# EAGLE design alu_slice (EAGLE 7.3.0)
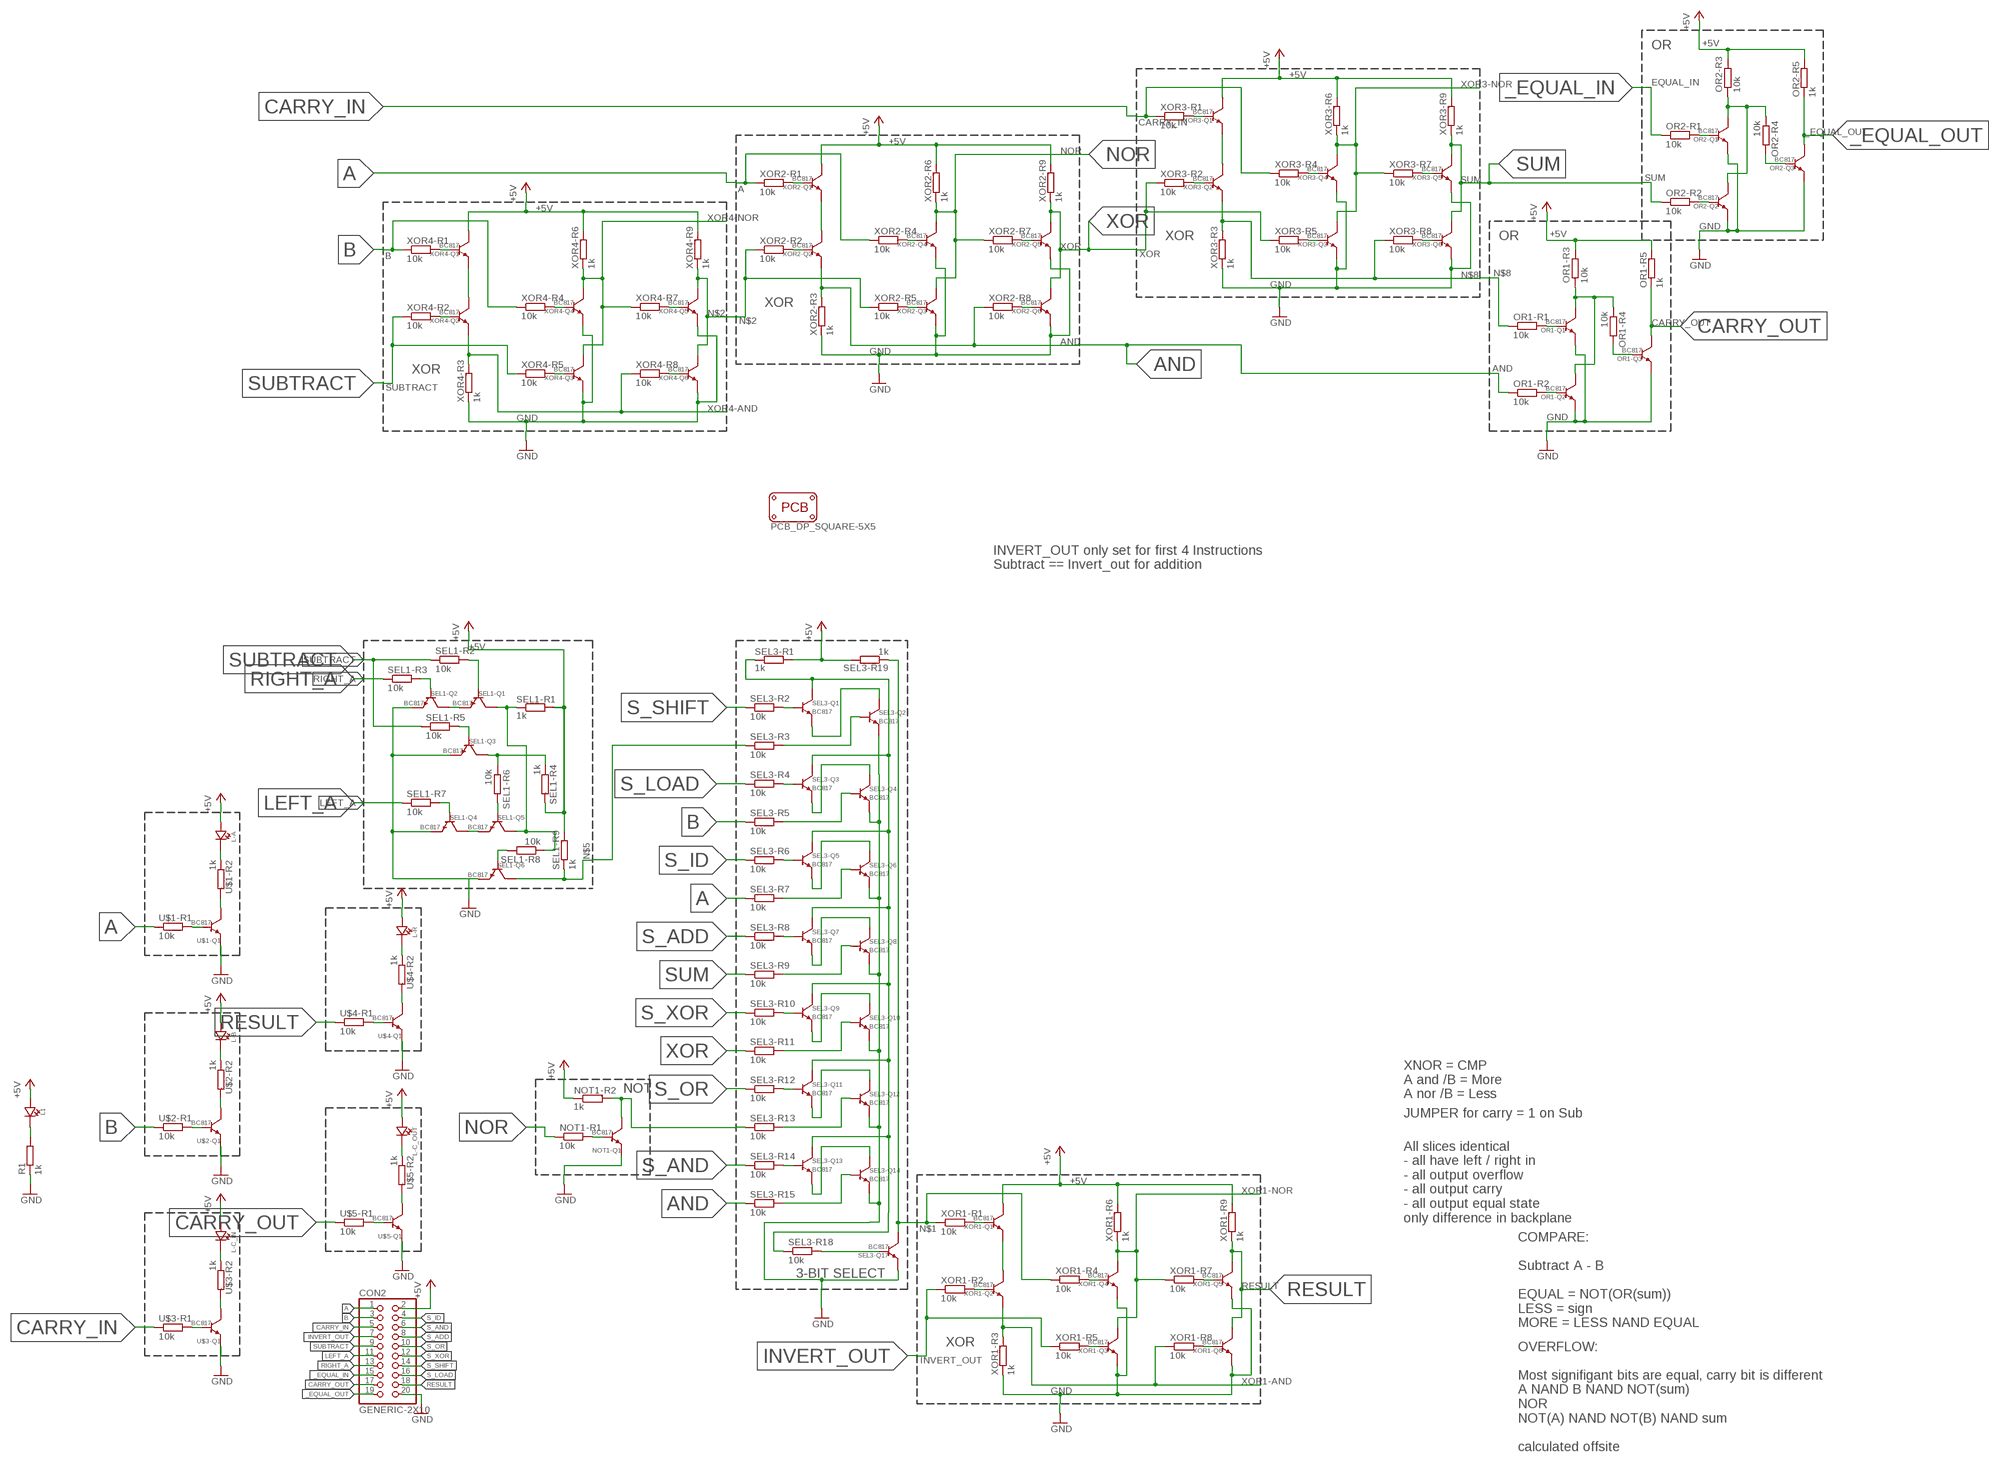
[diagram p0: schematic, sheet 1]

## Parts
CON2  GENERIC-2X10  [PINHEADER-100MIL-2X10-EDGE]
L1  LED0805  [CHIPLED_0805]
L-A  LED0603  [CHIPLED_0603]
L-B  LED0603  [CHIPLED_0603]
L-C_IN  LED0603  [CHIPLED_0603]
L-C_OUT  LED0603  [CHIPLED_0603]
L-R  LED0603  [CHIPLED_0603]
NOT1-Q1  BC817  TRANSISTOR-NPN-GENERICDEFAULT-SOT23-BEC  [SOT23]
NOT1-R1  10k  R-EU_R0603  [R0603]
NOT1-R2  1k  R-EU-MARKEDR0603  [R0603-MARK]
OR1-Q1  BC817  TRANSISTOR-NPN-GENERICDEFAULT-SOT23-BEC  [SOT23]
OR1-Q2  BC817  TRANSISTOR-NPN-GENERICDEFAULT-SOT23-BEC  [SOT23]
OR1-Q3  BC817  TRANSISTOR-NPN-GENERICDEFAULT-SOT23-BEC  [SOT23]
OR1-R1  10k  R-EU_R0603  [R0603]
OR1-R2  10k  R-EU_R0603  [R0603]
OR1-R3  10k  R-EU_R0603  [R0603]
OR1-R4  10k  R-EU_R0603  [R0603]
OR1-R5  1k  R-EU-MARKEDR0603  [R0603-MARK]
OR2-Q1  BC817  TRANSISTOR-NPN-GENERICDEFAULT-SOT23-BEC  [SOT23]
OR2-Q2  BC817  TRANSISTOR-NPN-GENERICDEFAULT-SOT23-BEC  [SOT23]
OR2-Q3  BC817  TRANSISTOR-NPN-GENERICDEFAULT-SOT23-BEC  [SOT23]
OR2-R1  10k  R-EU_R0603  [R0603]
OR2-R2  10k  R-EU_R0603  [R0603]
OR2-R3  10k  R-EU_R0603  [R0603]
OR2-R4  10k  R-EU_R0603  [R0603]
OR2-R5  1k  R-EU-MARKEDR0603  [R0603-MARK]
PCB1  PCB_DP_SQUARE-5X5  [DP5050_V1]
R1  1k  R-EU-MARKEDR0603  [R0603-MARK]
SEL1-Q1  BC817  TRANSISTOR-NPN-GENERICDEFAULT-SOT23-BEC  [SOT23]
SEL1-Q2  BC817  TRANSISTOR-NPN-GENERICDEFAULT-SOT23-BEC  [SOT23]
SEL1-Q3  BC817  TRANSISTOR-NPN-GENERICDEFAULT-SOT23-BEC  [SOT23]
SEL1-Q4  BC817  TRANSISTOR-NPN-GENERICDEFAULT-SOT23-BEC  [SOT23]
SEL1-Q5  BC817  TRANSISTOR-NPN-GENERICDEFAULT-SOT23-BEC  [SOT23]
SEL1-Q6  BC817  TRANSISTOR-NPN-GENERICDEFAULT-SOT23-BEC  [SOT23]
SEL1-R1  1k  R-EU-MARKEDR0603  [R0603-MARK]
SEL1-R2  10k  R-EU_R0603  [R0603]
SEL1-R3  10k  R-EU_R0603  [R0603]
SEL1-R4  1k  R-EU-MARKEDR0603  [R0603-MARK]
SEL1-R5  10k  R-EU_R0603  [R0603]
SEL1-R6  10k  R-EU_R0603  [R0603]
SEL1-R7  10k  R-EU_R0603  [R0603]
SEL1-R8  10k  R-EU_R0603  [R0603]
SEL1-R9  1k  R-EU-MARKEDR0603  [R0603-MARK]
SEL3-Q1  BC817  TRANSISTOR-NPN-GENERICDEFAULT-SOT23-BEC  [SOT23]
SEL3-Q2  BC817  TRANSISTOR-NPN-GENERICDEFAULT-SOT23-BEC  [SOT23]
SEL3-Q3  BC817  TRANSISTOR-NPN-GENERICDEFAULT-SOT23-BEC  [SOT23]
SEL3-Q4  BC817  TRANSISTOR-NPN-GENERICDEFAULT-SOT23-BEC  [SOT23]
SEL3-Q5  BC817  TRANSISTOR-NPN-GENERICDEFAULT-SOT23-BEC  [SOT23]
SEL3-Q6  BC817  TRANSISTOR-NPN-GENERICDEFAULT-SOT23-BEC  [SOT23]
SEL3-Q7  BC817  TRANSISTOR-NPN-GENERICDEFAULT-SOT23-BEC  [SOT23]
SEL3-Q8  BC817  TRANSISTOR-NPN-GENERICDEFAULT-SOT23-BEC  [SOT23]
SEL3-Q9  BC817  TRANSISTOR-NPN-GENERICDEFAULT-SOT23-BEC  [SOT23]
SEL3-Q10  BC817  TRANSISTOR-NPN-GENERICDEFAULT-SOT23-BEC  [SOT23]
SEL3-Q11  BC817  TRANSISTOR-NPN-GENERICDEFAULT-SOT23-BEC  [SOT23]
SEL3-Q12  BC817  TRANSISTOR-NPN-GENERICDEFAULT-SOT23-BEC  [SOT23]
SEL3-Q13  BC817  TRANSISTOR-NPN-GENERICDEFAULT-SOT23-BEC  [SOT23]
SEL3-Q14  BC817  TRANSISTOR-NPN-GENERICDEFAULT-SOT23-BEC  [SOT23]
SEL3-Q17  BC817  TRANSISTOR-NPN-GENERICDEFAULT-SOT23-BEC  [SOT23]
SEL3-R1  1k  R-EU-MARKEDR0603  [R0603-MARK]
SEL3-R2  10k  R-EU_R0603  [R0603]
SEL3-R3  10k  R-EU_R0603  [R0603]
SEL3-R4  10k  R-EU_R0603  [R0603]
SEL3-R5  10k  R-EU_R0603  [R0603]
SEL3-R6  10k  R-EU_R0603  [R0603]
SEL3-R7  10k  R-EU_R0603  [R0603]
SEL3-R8  10k  R-EU_R0603  [R0603]
SEL3-R9  10k  R-EU_R0603  [R0603]
SEL3-R10  10k  R-EU_R0603  [R0603]
SEL3-R11  10k  R-EU_R0603  [R0603]
SEL3-R12  10k  R-EU_R0603  [R0603]
SEL3-R13  10k  R-EU_R0603  [R0603]
SEL3-R14  10k  R-EU_R0603  [R0603]
SEL3-R15  10k  R-EU_R0603  [R0603]
SEL3-R18  10k  R-EU_R0603  [R0603]
SEL3-R19  1k  R-EU-MARKEDR0603  [R0603-MARK]
U$1-Q1  BC817  TRANSISTOR-NPN-GENERICDEFAULT-SOT23-BEC  [SOT23]
U$1-R1  10k  R-EU_R0603  [R0603]
U$1-R2  1k  R-EU-MARKEDR0603  [R0603-MARK]
U$2-Q1  BC817  TRANSISTOR-NPN-GENERICDEFAULT-SOT23-BEC  [SOT23]
U$2-R1  10k  R-EU_R0603  [R0603]
U$2-R2  1k  R-EU-MARKEDR0603  [R0603-MARK]
U$3-Q1  BC817  TRANSISTOR-NPN-GENERICDEFAULT-SOT23-BEC  [SOT23]
U$3-R1  10k  R-EU_R0603  [R0603]
U$3-R2  1k  R-EU-MARKEDR0603  [R0603-MARK]
U$4-Q1  BC817  TRANSISTOR-NPN-GENERICDEFAULT-SOT23-BEC  [SOT23]
U$4-R1  10k  R-EU_R0603  [R0603]
U$4-R2  1k  R-EU-MARKEDR0603  [R0603-MARK]
U$5-Q1  BC817  TRANSISTOR-NPN-GENERICDEFAULT-SOT23-BEC  [SOT23]
U$5-R1  10k  R-EU_R0603  [R0603]
U$5-R2  1k  R-EU-MARKEDR0603  [R0603-MARK]
XOR1-Q1  BC817  TRANSISTOR-NPN-GENERICDEFAULT-SOT23-BEC  [SOT23]
XOR1-Q2  BC817  TRANSISTOR-NPN-GENERICDEFAULT-SOT23-BEC  [SOT23]
XOR1-Q3  BC817  TRANSISTOR-NPN-GENERICDEFAULT-SOT23-BEC  [SOT23]
XOR1-Q4  BC817  TRANSISTOR-NPN-GENERICDEFAULT-SOT23-BEC  [SOT23]
XOR1-Q5  BC817  TRANSISTOR-NPN-GENERICDEFAULT-SOT23-BEC  [SOT23]
XOR1-Q6  BC817  TRANSISTOR-NPN-GENERICDEFAULT-SOT23-BEC  [SOT23]
XOR1-R1  10k  R-EU_R0603  [R0603]
XOR1-R2  10k  R-EU_R0603  [R0603]
XOR1-R3  1k  R-EU-MARKEDR0603  [R0603-MARK]
XOR1-R4  10k  R-EU_R0603  [R0603]
XOR1-R5  10k  R-EU_R0603  [R0603]
XOR1-R6  1k  R-EU-MARKEDR0603  [R0603-MARK]
XOR1-R7  10k  R-EU_R0603  [R0603]
XOR1-R8  10k  R-EU_R0603  [R0603]
XOR1-R9  1k  R-EU-MARKEDR0603  [R0603-MARK]
XOR2-Q1  BC817  TRANSISTOR-NPN-GENERICDEFAULT-SOT23-BEC  [SOT23]
XOR2-Q2  BC817  TRANSISTOR-NPN-GENERICDEFAULT-SOT23-BEC  [SOT23]
XOR2-Q3  BC817  TRANSISTOR-NPN-GENERICDEFAULT-SOT23-BEC  [SOT23]
XOR2-Q4  BC817  TRANSISTOR-NPN-GENERICDEFAULT-SOT23-BEC  [SOT23]
XOR2-Q5  BC817  TRANSISTOR-NPN-GENERICDEFAULT-SOT23-BEC  [SOT23]
XOR2-Q6  BC817  TRANSISTOR-NPN-GENERICDEFAULT-SOT23-BEC  [SOT23]
XOR2-R1  10k  R-EU_R0603  [R0603]
XOR2-R2  10k  R-EU_R0603  [R0603]
XOR2-R3  1k  R-EU-MARKEDR0603  [R0603-MARK]
XOR2-R4  10k  R-EU_R0603  [R0603]
XOR2-R5  10k  R-EU_R0603  [R0603]
XOR2-R6  1k  R-EU-MARKEDR0603  [R0603-MARK]
XOR2-R7  10k  R-EU_R0603  [R0603]
XOR2-R8  10k  R-EU_R0603  [R0603]
XOR2-R9  1k  R-EU-MARKEDR0603  [R0603-MARK]
XOR3-Q1  BC817  TRANSISTOR-NPN-GENERICDEFAULT-SOT23-BEC  [SOT23]
XOR3-Q2  BC817  TRANSISTOR-NPN-GENERICDEFAULT-SOT23-BEC  [SOT23]
XOR3-Q3  BC817  TRANSISTOR-NPN-GENERICDEFAULT-SOT23-BEC  [SOT23]
XOR3-Q4  BC817  TRANSISTOR-NPN-GENERICDEFAULT-SOT23-BEC  [SOT23]
XOR3-Q5  BC817  TRANSISTOR-NPN-GENERICDEFAULT-SOT23-BEC  [SOT23]
XOR3-Q6  BC817  TRANSISTOR-NPN-GENERICDEFAULT-SOT23-BEC  [SOT23]
XOR3-R1  10k  R-EU_R0603  [R0603]
XOR3-R2  10k  R-EU_R0603  [R0603]
XOR3-R3  1k  R-EU-MARKEDR0603  [R0603-MARK]
XOR3-R4  10k  R-EU_R0603  [R0603]
XOR3-R5  10k  R-EU_R0603  [R0603]
XOR3-R6  1k  R-EU-MARKEDR0603  [R0603-MARK]
XOR3-R7  10k  R-EU_R0603  [R0603]
XOR3-R8  10k  R-EU_R0603  [R0603]
XOR3-R9  1k  R-EU-MARKEDR0603  [R0603-MARK]
XOR4-Q1  BC817  TRANSISTOR-NPN-GENERICDEFAULT-SOT23-BEC  [SOT23]
XOR4-Q2  BC817  TRANSISTOR-NPN-GENERICDEFAULT-SOT23-BEC  [SOT23]
XOR4-Q3  BC817  TRANSISTOR-NPN-GENERICDEFAULT-SOT23-BEC  [SOT23]
XOR4-Q4  BC817  TRANSISTOR-NPN-GENERICDEFAULT-SOT23-BEC  [SOT23]
XOR4-Q5  BC817  TRANSISTOR-NPN-GENERICDEFAULT-SOT23-BEC  [SOT23]
XOR4-Q6  BC817  TRANSISTOR-NPN-GENERICDEFAULT-SOT23-BEC  [SOT23]
XOR4-R1  10k  R-EU_R0603  [R0603]
XOR4-R2  10k  R-EU_R0603  [R0603]
XOR4-R3  1k  R-EU-MARKEDR0603  [R0603-MARK]
XOR4-R4  10k  R-EU_R0603  [R0603]
XOR4-R5  10k  R-EU_R0603  [R0603]
XOR4-R6  1k  R-EU-MARKEDR0603  [R0603-MARK]
XOR4-R7  10k  R-EU_R0603  [R0603]
XOR4-R8  10k  R-EU_R0603  [R0603]
XOR4-R9  1k  R-EU-MARKEDR0603  [R0603-MARK]

## Nets
+5V [PWR]: CON2.2 L1.A L-A.A L-B.A L-C_IN.A L-C_OUT.A L-R.A NOT1-R2.1 OR1-R3.2 OR1-R5.2 OR2-R3.2 OR2-R5.2 SEL1-R1.2 SEL1-R4.2 SEL1-R9.2 SEL3-R1.2 SEL3-R19.2 XOR1-Q1.P$3(COLLECTOR) XOR1-R6.2 XOR1-R9.2 XOR2-Q1.P$3(COLLECTOR) XOR2-R6.2 XOR2-R9.2 XOR3-Q1.P$3(COLLECTOR) XOR3-R6.2 XOR3-R9.2 XOR4-Q1.P$3(COLLECTOR) XOR4-R6.2 XOR4-R9.2
_EQUAL_IN: CON2.15 OR2-R1.1
_EQUAL_OUT: CON2.19 OR2-Q3.P$3(COLLECTOR) OR2-R5.1
A: CON2.1 SEL3-R7.1 U$1-R1.1 XOR2-R1.1 XOR2-R4.1
AND: OR1-R2.1 SEL3-R15.1 XOR2-Q2.P$2(EMITTER) XOR2-R3.2 XOR2-R8.1
B: CON2.3 SEL3-R5.1 U$2-R1.1 XOR4-R1.1 XOR4-R4.1
CARRY_IN: CON2.5 U$3-R1.1 XOR3-R1.1 XOR3-R4.1
CARRY_OUT: CON2.17 OR1-Q3.P$3(COLLECTOR) OR1-R5.1 U$5-R1.1
GND [PWR]: CON2.20 NOT1-Q1.P$2(EMITTER) OR1-Q1.P$2(EMITTER) OR1-Q2.P$2(EMITTER) OR1-Q3.P$2(EMITTER) OR2-Q1.P$2(EMITTER) OR2-Q2.P$2(EMITTER) OR2-Q3.P$2(EMITTER) R1.1 SEL1-Q2.P$2(EMITTER) SEL1-Q3.P$2(EMITTER) SEL1-Q4.P$2(EMITTER) SEL1-Q6.P$2(EMITTER) SEL3-Q2.P$2(EMITTER) SEL3-Q4.P$2(EMITTER) SEL3-Q6.P$2(EMITTER) SEL3-Q8.P$2(EMITTER) SEL3-Q10.P$2(EMITTER) SEL3-Q12.P$2(EMITTER) SEL3-Q14.P$2(EMITTER) SEL3-Q17.P$2(EMITTER) U$1-Q1.P$2(EMITTER) U$2-Q1.P$2(EMITTER) U$3-Q1.P$2(EMITTER) U$4-Q1.P$2(EMITTER) U$5-Q1.P$2(EMITTER) XOR1-Q3.P$2(EMITTER) XOR1-Q4.P$2(EMITTER) XOR1-Q5.P$2(EMITTER) XOR1-Q6.P$2(EMITTER) XOR1-R3.1 XOR2-Q3.P$2(EMITTER) XOR2-Q4.P$2(EMITTER) XOR2-Q5.P$2(EMITTER) XOR2-Q6.P$2(EMITTER) XOR2-R3.1 XOR3-Q3.P$2(EMITTER) XOR3-Q4.P$2(EMITTER) XOR3-Q5.P$2(EMITTER) XOR3-Q6.P$2(EMITTER) XOR3-R3.1 XOR4-Q3.P$2(EMITTER) XOR4-Q4.P$2(EMITTER) XOR4-Q5.P$2(EMITTER) XOR4-Q6.P$2(EMITTER) XOR4-R3.1
INVERT_OUT: CON2.7 XOR1-R2.1 XOR1-R5.1
LEFT_A: CON2.11 SEL1-R7.1
N$1: SEL3-Q17.P$3(COLLECTOR) SEL3-R19.1 XOR1-R1.1 XOR1-R4.1
N$2: XOR2-R2.1 XOR2-R5.1 XOR4-Q5.P$3(COLLECTOR) XOR4-Q6.P$3(COLLECTOR) XOR4-R9.1
N$3: NOT1-Q1.P$3(COLLECTOR) NOT1-R2.2 SEL3-R13.1
N$5: SEL1-Q6.P$3(COLLECTOR) SEL1-R9.1 SEL3-R3.1
N$6: L1.C R1.2
N$8: OR1-R1.1 XOR3-Q2.P$2(EMITTER) XOR3-R3.2 XOR3-R8.1
NOR: NOT1-R1.1 XOR2-Q3.P$3(COLLECTOR) XOR2-Q4.P$3(COLLECTOR) XOR2-R6.1 XOR2-R7.1
NOT1-N$14: NOT1-Q1.P$1(BASE) NOT1-R1.2
OR1-N$7: OR1-Q1.P$1(BASE) OR1-R1.2
OR1-N$9: OR1-Q2.P$1(BASE) OR1-R2.2
OR1-N$10: OR1-Q3.P$1(BASE) OR1-R4.2
OR1-N$11: OR1-Q1.P$3(COLLECTOR) OR1-Q2.P$3(COLLECTOR) OR1-R3.1 OR1-R4.1
OR2-N$7: OR2-Q1.P$1(BASE) OR2-R1.2
OR2-N$9: OR2-Q2.P$1(BASE) OR2-R2.2
OR2-N$10: OR2-Q3.P$1(BASE) OR2-R4.2
OR2-N$11: OR2-Q1.P$3(COLLECTOR) OR2-Q2.P$3(COLLECTOR) OR2-R3.1 OR2-R4.1
RESULT: CON2.18 U$4-R1.1 XOR1-Q5.P$3(COLLECTOR) XOR1-Q6.P$3(COLLECTOR) XOR1-R9.1
RIGHT_A: CON2.13 SEL1-R3.1
S_ADD: CON2.8 SEL3-R8.1
S_AND: CON2.6 SEL3-R14.1
S_ID: CON2.4 SEL3-R6.1
S_LOAD: CON2.16 SEL3-R4.1
S_OR: CON2.10 SEL3-R12.1
S_SHIFT: CON2.14 SEL3-R2.1
S_XOR: CON2.12 SEL3-R10.1
SEL1-I-S2: SEL1-Q3.P$3(COLLECTOR) SEL1-R4.1 SEL1-R6.1
SEL1-N$53: SEL1-Q1.P$1(BASE) SEL1-R2.2
SEL1-N$55: SEL1-Q2.P$1(BASE) SEL1-R3.2
SEL1-N$56: SEL1-Q1.P$2(EMITTER) SEL1-Q2.P$3(COLLECTOR)
SEL1-N$57: SEL1-Q5.P$1(BASE) SEL1-R6.2
SEL1-N$58: SEL1-Q4.P$1(BASE) SEL1-R7.2
SEL1-N$59: SEL1-Q4.P$3(COLLECTOR) SEL1-Q5.P$2(EMITTER)
SEL1-N$60: SEL1-Q6.P$1(BASE) SEL1-R8.2
SEL1-N$62: SEL1-Q3.P$1(BASE) SEL1-R5.2
SEL1-SEL_INT1: SEL1-Q1.P$3(COLLECTOR) SEL1-Q5.P$3(COLLECTOR) SEL1-R1.1 SEL1-R8.1
SEL3-N$27: SEL3-Q1.P$1(BASE) SEL3-R2.2
SEL3-N$28: SEL3-Q2.P$1(BASE) SEL3-R3.2
SEL3-N$29: SEL3-Q1.P$2(EMITTER) SEL3-Q2.P$3(COLLECTOR)
SEL3-N$32: SEL3-Q3.P$1(BASE) SEL3-R4.2
SEL3-N$33: SEL3-Q4.P$1(BASE) SEL3-R5.2
SEL3-N$34: SEL3-Q3.P$2(EMITTER) SEL3-Q4.P$3(COLLECTOR)
SEL3-N$35: SEL3-Q5.P$1(BASE) SEL3-R6.2
SEL3-N$36: SEL3-Q6.P$1(BASE) SEL3-R7.2
SEL3-N$37: SEL3-Q5.P$2(EMITTER) SEL3-Q6.P$3(COLLECTOR)
SEL3-N$38: SEL3-Q7.P$1(BASE) SEL3-R8.2
SEL3-N$39: SEL3-Q8.P$1(BASE) SEL3-R9.2
SEL3-N$40: SEL3-Q7.P$2(EMITTER) SEL3-Q8.P$3(COLLECTOR)
SEL3-N$41: SEL3-Q9.P$1(BASE) SEL3-R10.2
SEL3-N$42: SEL3-Q10.P$1(BASE) SEL3-R11.2
SEL3-N$43: SEL3-Q9.P$2(EMITTER) SEL3-Q10.P$3(COLLECTOR)
SEL3-N$44: SEL3-Q11.P$1(BASE) SEL3-R12.2
SEL3-N$45: SEL3-Q12.P$1(BASE) SEL3-R13.2
SEL3-N$46: SEL3-Q11.P$2(EMITTER) SEL3-Q12.P$3(COLLECTOR)
SEL3-N$47: SEL3-Q13.P$1(BASE) SEL3-R14.2
SEL3-N$48: SEL3-Q14.P$1(BASE) SEL3-R15.2
SEL3-N$49: SEL3-Q13.P$2(EMITTER) SEL3-Q14.P$3(COLLECTOR)
SEL3-N$54: SEL3-Q17.P$1(BASE) SEL3-R18.2
SEL3-SEL_INT: SEL3-Q1.P$3(COLLECTOR) SEL3-Q3.P$3(COLLECTOR) SEL3-Q5.P$3(COLLECTOR) SEL3-Q7.P$3(COLLECTOR) SEL3-Q9.P$3(COLLECTOR) SEL3-Q11.P$3(COLLECTOR) SEL3-Q13.P$3(COLLECTOR) SEL3-R1.1 SEL3-R18.1
SUBTRACT: CON2.9 SEL1-R2.1 SEL1-R5.1 XOR4-R2.1 XOR4-R5.1
SUM: OR2-R2.1 SEL3-R9.1 XOR3-Q5.P$3(COLLECTOR) XOR3-Q6.P$3(COLLECTOR) XOR3-R9.1
U$1-INT: L-A.C U$1-R2.1
U$1-N$1: U$1-Q1.P$3(COLLECTOR) U$1-R2.2
U$1-N$16: U$1-Q1.P$1(BASE) U$1-R1.2
U$2-INT: L-B.C U$2-R2.1
U$2-N$1: U$2-Q1.P$3(COLLECTOR) U$2-R2.2
U$2-N$16: U$2-Q1.P$1(BASE) U$2-R1.2
U$3-INT: L-C_IN.C U$3-R2.1
U$3-N$1: U$3-Q1.P$3(COLLECTOR) U$3-R2.2
U$3-N$16: U$3-Q1.P$1(BASE) U$3-R1.2
U$4-INT: L-R.C U$4-R2.1
U$4-N$1: U$4-Q1.P$3(COLLECTOR) U$4-R2.2
U$4-N$16: U$4-Q1.P$1(BASE) U$4-R1.2
U$5-INT: L-C_OUT.C U$5-R2.1
U$5-N$1: U$5-Q1.P$3(COLLECTOR) U$5-R2.2
U$5-N$16: U$5-Q1.P$1(BASE) U$5-R1.2
XOR: SEL3-R11.1 XOR2-Q5.P$3(COLLECTOR) XOR2-Q6.P$3(COLLECTOR) XOR2-R9.1 XOR3-R2.1 XOR3-R5.1
XOR1-AND: XOR1-Q2.P$2(EMITTER) XOR1-R3.2 XOR1-R8.1
XOR1-N$19: XOR1-Q1.P$2(EMITTER) XOR1-Q2.P$3(COLLECTOR)
XOR1-N$21: XOR1-Q1.P$1(BASE) XOR1-R1.2
XOR1-N$22: XOR1-Q2.P$1(BASE) XOR1-R2.2
XOR1-N$23: XOR1-Q3.P$1(BASE) XOR1-R5.2
XOR1-N$24: XOR1-Q4.P$1(BASE) XOR1-R4.2
XOR1-N$25: XOR1-Q6.P$1(BASE) XOR1-R8.2
XOR1-N$26: XOR1-Q5.P$1(BASE) XOR1-R7.2
XOR1-NOR: XOR1-Q3.P$3(COLLECTOR) XOR1-Q4.P$3(COLLECTOR) XOR1-R6.1 XOR1-R7.1
XOR2-N$19: XOR2-Q1.P$2(EMITTER) XOR2-Q2.P$3(COLLECTOR)
XOR2-N$21: XOR2-Q1.P$1(BASE) XOR2-R1.2
XOR2-N$22: XOR2-Q2.P$1(BASE) XOR2-R2.2
XOR2-N$23: XOR2-Q3.P$1(BASE) XOR2-R5.2
XOR2-N$24: XOR2-Q4.P$1(BASE) XOR2-R4.2
XOR2-N$25: XOR2-Q6.P$1(BASE) XOR2-R8.2
XOR2-N$26: XOR2-Q5.P$1(BASE) XOR2-R7.2
XOR3-N$19: XOR3-Q1.P$2(EMITTER) XOR3-Q2.P$3(COLLECTOR)
XOR3-N$21: XOR3-Q1.P$1(BASE) XOR3-R1.2
XOR3-N$22: XOR3-Q2.P$1(BASE) XOR3-R2.2
XOR3-N$23: XOR3-Q3.P$1(BASE) XOR3-R5.2
XOR3-N$24: XOR3-Q4.P$1(BASE) XOR3-R4.2
XOR3-N$25: XOR3-Q6.P$1(BASE) XOR3-R8.2
XOR3-N$26: XOR3-Q5.P$1(BASE) XOR3-R7.2
XOR3-NOR: XOR3-Q3.P$3(COLLECTOR) XOR3-Q4.P$3(COLLECTOR) XOR3-R6.1 XOR3-R7.1
XOR4-AND: XOR4-Q2.P$2(EMITTER) XOR4-R3.2 XOR4-R8.1
XOR4-N$19: XOR4-Q1.P$2(EMITTER) XOR4-Q2.P$3(COLLECTOR)
XOR4-N$21: XOR4-Q1.P$1(BASE) XOR4-R1.2
XOR4-N$22: XOR4-Q2.P$1(BASE) XOR4-R2.2
XOR4-N$23: XOR4-Q3.P$1(BASE) XOR4-R5.2
XOR4-N$24: XOR4-Q4.P$1(BASE) XOR4-R4.2
XOR4-N$25: XOR4-Q6.P$1(BASE) XOR4-R8.2
XOR4-N$26: XOR4-Q5.P$1(BASE) XOR4-R7.2
XOR4-NOR: XOR4-Q3.P$3(COLLECTOR) XOR4-Q4.P$3(COLLECTOR) XOR4-R6.1 XOR4-R7.1

## Notes on the sheet
- OR
- XOR | OR
- XOR
- XOR
- INVERT_OUT only set for first 4 Instructions
  Subtract == Invert_out for addition
- XNOR = CMP
- NOT
- A and /B = More
  A nor /B = Less
- JUMPER for carry = 1 on Sub
- All slices identical
  - all have left / right in
  - all output overflow
  - all output carry
  - all output equal state
  only difference in backplane
- 3-BIT SELECT
- COMPARE:
  
  Subtract A - B
  
  EQUAL = NOT(OR(sum))
  LESS = sign
  MORE = LESS NAND EQUAL
- XOR
- OVERFLOW:
  
  Most signifigant bits are equal, carry bit is different
  A NAND B NAND NOT(sum)
  NOR
  NOT(A) NAND NOT(B) NAND sum
  
  calculated offsite

## Library data of the parts
CON2 = p.peter-connectors:GENERIC-2X10
L1 L-A L-B L-C_IN L-C_OUT L-R = p.peter-leds:LED
NOT1-Q1 OR1-Q1-OR1-Q3 OR2-Q1-OR2-Q3 SEL1-Q1-SEL1-Q6 SEL3-Q1-SEL3-Q14 SEL3-Q17 U$1-Q1 U$2-Q1 U$3-Q1 U$4-Q1 U$5-Q1 XOR1-Q1-XOR1-Q6 XOR2-Q1-XOR2-Q6 XOR3-Q1-XOR3-Q6 XOR4-Q1-XOR4-Q6 = p.peter-gator:TRANSISTOR-NPN-GENERIC; SV_SPICE_MODEL: NPN (); SV_SPICE_ORDER: COLLECTOR;BASE;EMITTER; SV_SPICE_PREFIX: Q
NOT1-R1 OR1-R1-OR1-R4 OR2-R1-OR2-R4 SEL1-R2 SEL1-R3 SEL1-R5-SEL1-R8 SEL3-R2-SEL3-R15 SEL3-R18 U$1-R1 U$2-R1 U$3-R1 U$4-R1 U$5-R1 XOR1-R1 XOR1-R2 XOR1-R4 XOR1-R5 XOR1-R7 XOR1-R8 XOR2-R1 XOR2-R2 XOR2-R4 XOR2-R5 XOR2-R7 XOR2-R8 XOR3-R1 XOR3-R2 XOR3-R4 XOR3-R5 XOR3-R7 XOR3-R8 XOR4-R1 XOR4-R2 XOR4-R4 XOR4-R5 XOR4-R7 XOR4-R8 = p.peter-gator:R-EU_: RESISTOR, European symbol; SV_SPICE_ORDER: 1;2; SV_SPICE_PREFIX: R
NOT1-R2 OR1-R5 OR2-R5 R1 SEL1-R1 SEL1-R4 SEL1-R9 SEL3-R1 SEL3-R19 U$1-R2 U$2-R2 U$3-R2 U$4-R2 U$5-R2 XOR1-R3 XOR1-R6 XOR1-R9 XOR2-R3 XOR2-R6 XOR2-R9 XOR3-R3 XOR3-R6 XOR3-R9 XOR4-R3 XOR4-R6 XOR4-R9 = p.peter-rcl:R-EU-MARKED
PCB1 = dp_pcb:PCB_DP_SQUARE: Dangerous Prototypes Standard Square PCB sizes

## Net classes
0 default: width 0.2 mm, drill 0.5 mm
1 PWR: width 0.2 mm, drill 0.5 mm

## Board
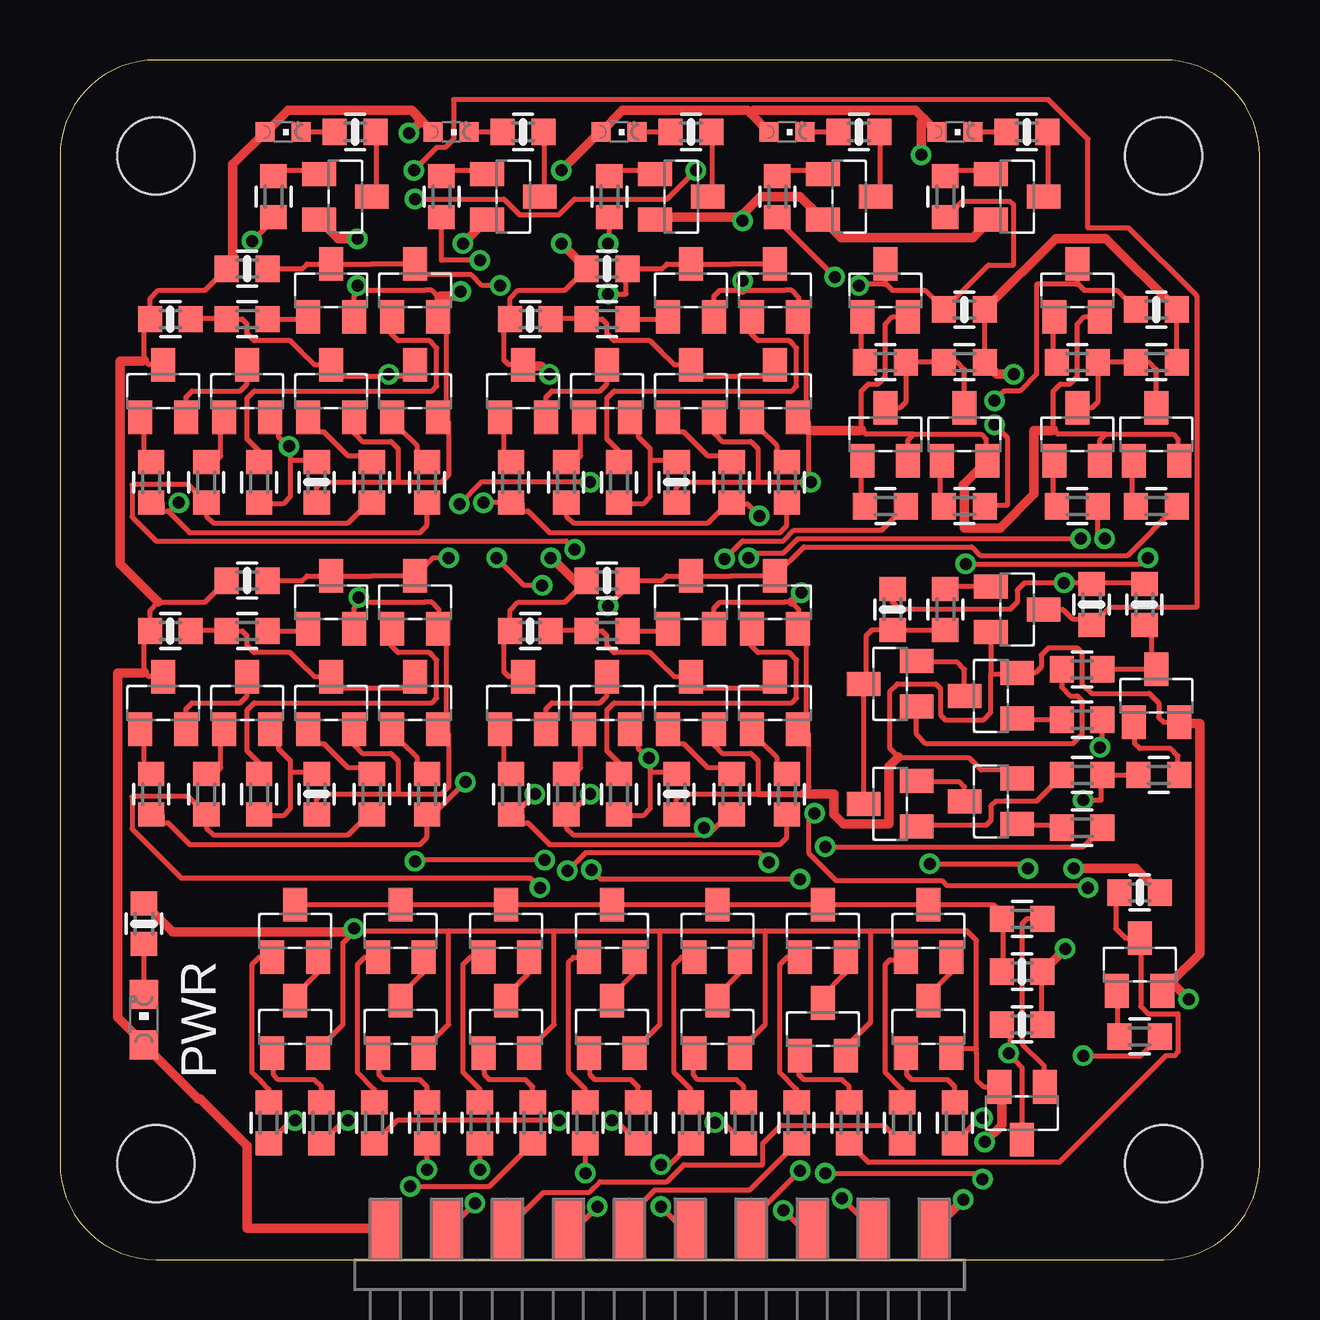
[diagram p1: board, top side]
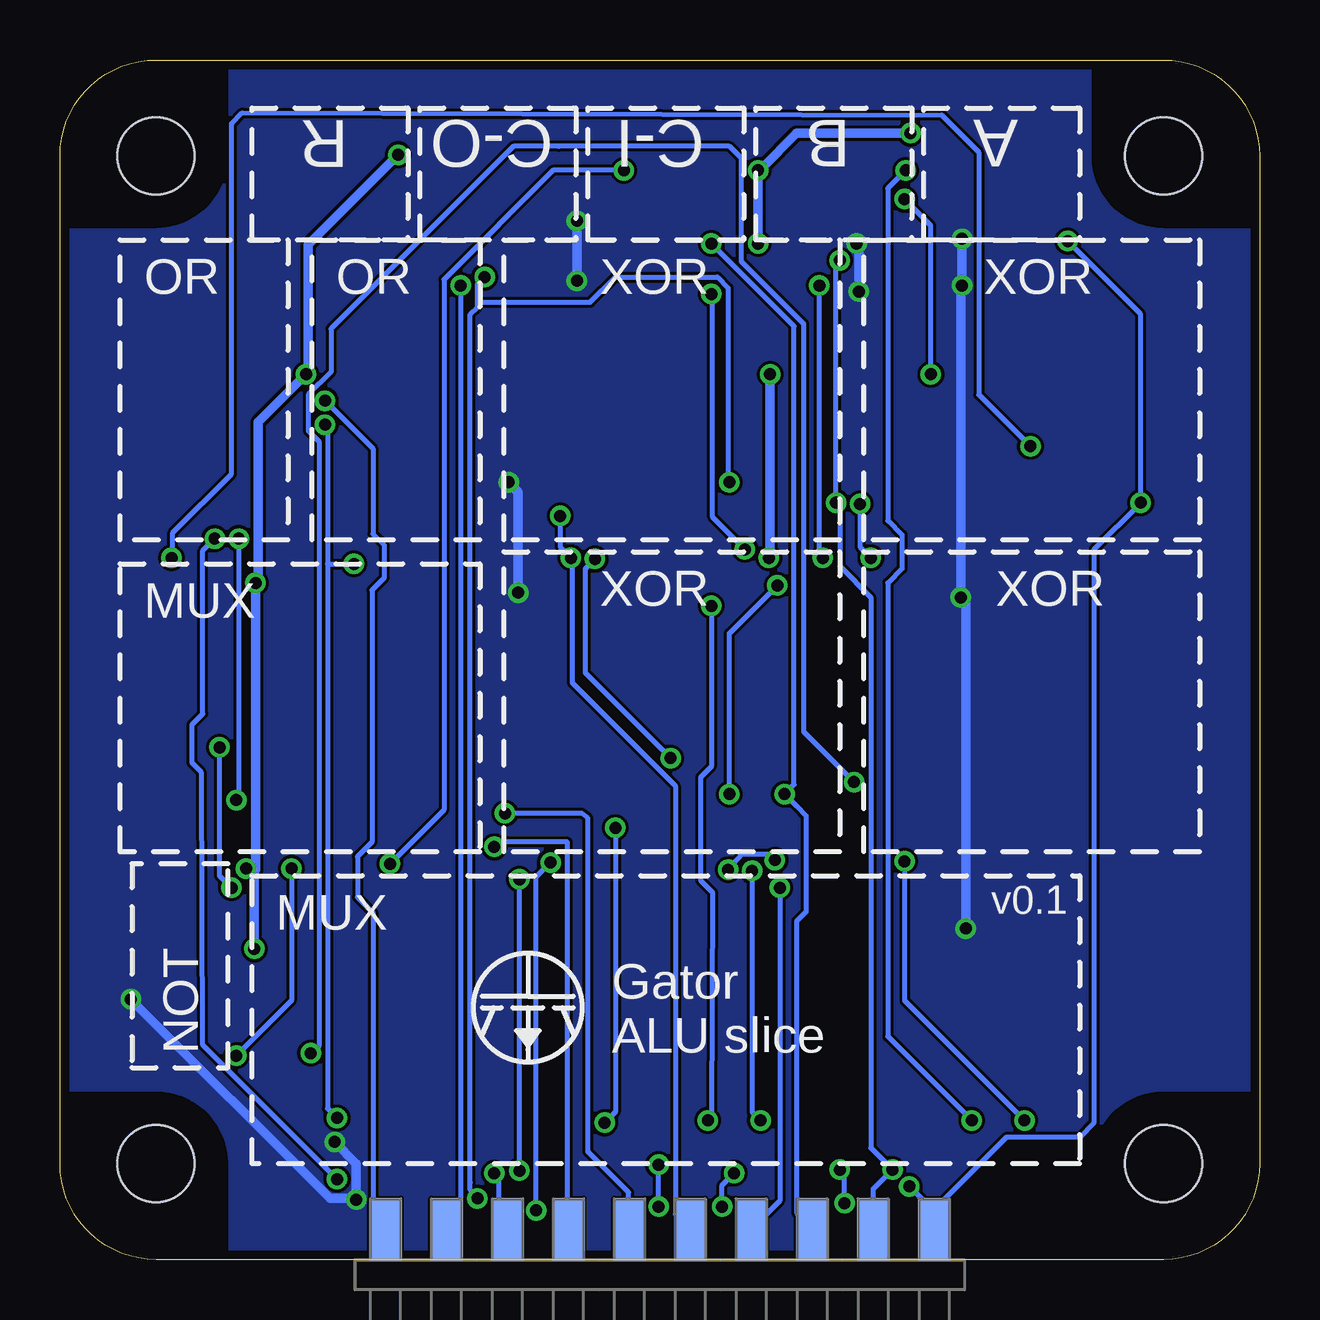
[diagram p2: board, bottom side, seen from below]

Size 50 x 50 mm. Coordinates in mm from the lower left corner, seen from the top.
Copper layers (1*16): Top 0.0356mm / dielectric 1.5011mm / Bottom 0.0356mm
Design rules "oshpark *": minimum track width 5mil, minimum drill 12mil, track to track 5mil, track to pad 5mil, pad to pad 5mil, via to via 5mil, smd to smd 5mil, copper to edge 15mil, drill to drill 6mil, minimum pad ring 7mil, minimum via ring 7mil, stop-mask expansion 4mil, vias tented up to drill 4.1mm, thermal gap 10mil

### Footprints (pad centres in the part's own frame; a part is rotated, then mirrored left to right if it is on the bottom)
PINHEADER-100MIL-2X10-EDGE = smd 1.27 x 2.54 bottom: 1 -11.43,1.27; 3 -8.89,1.27; 5 -6.35,1.27; 7 -3.81,1.27; 9 -1.27,1.27; 11 1.27,1.27; 13 3.81,1.27; 15 6.35,1.27; 17 8.89,1.27; 19 11.43,1.27 | smd 1.27 x 2.54: 2 -11.43,1.27; 4 -8.89,1.27; 6 -6.35,1.27; 8 -3.81,1.27; 10 -1.27,1.27; 12 1.27,1.27; 14 3.81,1.27; 16 6.35,1.27; 18 8.89,1.27; 20 11.43,1.27
CHIPLED_0805 = smd 1.2 x 1.2: A 0,-1.05; C 0,1.05
CHIPLED_0603 = smd 0.8 x 0.8: A 0,-0.75; C 0,0.75
SOT23 = smd 1 x 1.4: P$1 -0.95,-1.1; P$2 0.95,-1.1; P$3 0,1.1
R0603 = smd 1 x 1.1: 1 -0.85,0; 2 0.85,0
R0603-MARK = smd 1 x 1.1: 1 -0.85,0; 2 0.85,0
DP5050_V1 = hole 3.2: 4,4; 46,4; 46,46; 4,46

### Placement (x,y rotation side)
CON2  25,0 0 top
L1  3.5,10 0 top
L-A  9.3,47 270 top
L-B  16.3,47 270 top
L-C_IN  23.3,47 270 top
L-C_OUT  37.3,47 270 top
L-R  30.3,47 270 top
NOT1-Q1  45,12.3 0 top
NOT1-R1  45,9.3 180 top
NOT1-R2  45,15.3 180 top
OR1-Q1  34.4,34.4 0 top
OR1-Q2  37.7,34.4 0 top
OR1-Q3  34.4,40.4 0 top
OR1-R1  34.4,31.4 180 top
OR1-R2  37.7,31.4 180 top
OR1-R3  37.7,37.4 0 top
OR1-R4  34.4,37.4 180 top
OR1-R5  37.7,39.6 0 top
OR2-Q1  42.4,34.4 0 top
OR2-Q2  45.7,34.4 0 top
OR2-Q3  42.4,40.4 0 top
OR2-R1  42.4,31.4 180 top
OR2-R2  45.7,31.4 180 top
OR2-R3  45.7,37.4 0 top
OR2-R4  42.4,37.4 180 top
OR2-R5  45.7,39.6 0 top
PCB1  0,0 0 top
R1  3.5,14 270 top
SEL1-Q1  34.6,19 90 top
SEL1-Q2  38.8,19.1 90 top
SEL1-Q3  45.7,23.5 0 top
SEL1-Q4  38.8,23.5 90 top
SEL1-Q5  34.6,24 90 top
SEL1-Q6  39.9,27.1 270 top
SEL1-R1  34.7,27.1 90 top
SEL1-R2  42.6,20.2 180 top
SEL1-R3  42.6,18 180 top
SEL1-R4  45.2,27.3 90 top
SEL1-R5  45.8,20.2 0 top
SEL1-R6  42.6,24.6 180 top
SEL1-R7  42.6,22.5 180 top
SEL1-R8  36.9,27.1 90 top
SEL1-R9  43,27.3 90 top
SEL3-Q1  9.8,13.7 0 top
SEL3-Q2  9.8,9.7 0 top
SEL3-Q3  14.2,13.7 0 top
SEL3-Q4  14.2,9.7 0 top
SEL3-Q5  18.6,13.7 0 top
SEL3-Q6  18.6,9.7 0 top
SEL3-Q7  23,13.7 0 top
SEL3-Q8  23,9.7 0 top
SEL3-Q9  27.4,13.7 0 top
SEL3-Q10  27.4,9.7 0 top
SEL3-Q11  31.8,13.7 0 top
SEL3-Q12  31.8,9.6 0 top
SEL3-Q13  36.2,13.7 0 top
SEL3-Q14  36.2,9.7 0 top
SEL3-Q17  40.1,6.1 180 top
SEL3-R1  40.1,12 0 top
SEL3-R2  8.7,5.7 90 top
SEL3-R3  10.9,5.7 90 top
SEL3-R4  13.1,5.7 90 top
SEL3-R5  15.3,5.7 90 top
SEL3-R6  17.5,5.7 90 top
SEL3-R7  19.7,5.7 90 top
SEL3-R8  21.9,5.7 90 top
SEL3-R9  24.1,5.7 90 top
SEL3-R10  26.3,5.7 90 top
SEL3-R11  28.5,5.7 90 top
SEL3-R12  30.7,5.7 90 top
SEL3-R13  32.9,5.7 90 top
SEL3-R14  35.1,5.7 90 top
SEL3-R15  37.3,5.7 90 top
SEL3-R18  40.1,14.2 0 top
SEL3-R19  40.1,9.8 0 top
U$1  [LOGO-JUSTGEEK-XS]  30.5,10.5 0 bottom
U$1-Q1  11.9,44.3 270 top
U$1-R1  8.9,44.3 90 top
U$1-R2  12.3,47 0 top
U$2-Q1  18.9,44.3 270 top
U$2-R1  15.9,44.3 90 top
U$2-R2  19.3,47 0 top
U$3-Q1  25.9,44.3 270 top
U$3-R1  22.9,44.3 90 top
U$3-R2  26.3,47 0 top
U$4-Q1  32.9,44.3 270 top
U$4-R1  29.9,44.3 90 top
U$4-R2  33.3,47 0 top
U$5-Q1  39.9,44.3 270 top
U$5-R1  36.9,44.3 90 top
U$5-R2  40.3,47 0 top
XOR1-Q1  4.3,23.2 0 top
XOR1-Q2  7.8,23.2 0 top
XOR1-Q3  11.3,23.2 0 top
XOR1-Q4  14.8,23.2 0 top
XOR1-Q5  11.3,27.4 0 top
XOR1-Q6  14.8,27.4 0 top
XOR1-R1  3.8,19.4 90 top
XOR1-R2  6.1,19.4 90 top
XOR1-R3  10.7,19.4 90 top
XOR1-R4  15.3,19.4 90 top
XOR1-R5  13,19.4 90 top
XOR1-R6  4.6,26.2 180 top
XOR1-R7  7.8,26.2 0 top
XOR1-R8  8.3,19.4 90 top
XOR1-R9  7.8,28.3 180 top
XOR2-Q1  4.3,36.2 0 top
XOR2-Q2  7.8,36.2 0 top
XOR2-Q3  11.3,36.2 0 top
XOR2-Q4  14.8,36.2 0 top
XOR2-Q5  11.3,40.4 0 top
XOR2-Q6  14.8,40.4 0 top
XOR2-R1  3.8,32.4 90 top
XOR2-R2  6.1,32.4 90 top
XOR2-R3  10.7,32.4 90 top
XOR2-R4  15.3,32.4 90 top
XOR2-R5  13,32.4 90 top
XOR2-R6  4.6,39.2 180 top
XOR2-R7  7.8,39.2 0 top
XOR2-R8  8.3,32.4 90 top
XOR2-R9  7.8,41.3 180 top
XOR3-Q1  19.3,23.2 0 top
XOR3-Q2  22.8,23.2 0 top
XOR3-Q3  26.3,23.2 0 top
XOR3-Q4  29.8,23.2 0 top
XOR3-Q5  26.3,27.4 0 top
XOR3-Q6  29.8,27.4 0 top
XOR3-R1  18.8,19.4 90 top
XOR3-R2  21.1,19.4 90 top
XOR3-R3  25.7,19.4 90 top
XOR3-R4  30.3,19.4 90 top
XOR3-R5  28,19.4 90 top
XOR3-R6  19.6,26.2 180 top
XOR3-R7  22.8,26.2 0 top
XOR3-R8  23.3,19.4 90 top
XOR3-R9  22.8,28.3 180 top
XOR4-Q1  19.3,36.2 0 top
XOR4-Q2  22.8,36.2 0 top
XOR4-Q3  26.3,36.2 0 top
XOR4-Q4  29.8,36.2 0 top
XOR4-Q5  26.3,40.4 0 top
XOR4-Q6  29.8,40.4 0 top
XOR4-R1  18.8,32.4 90 top
XOR4-R2  21.1,32.4 90 top
XOR4-R3  25.7,32.4 90 top
XOR4-R4  30.3,32.4 90 top
XOR4-R5  28,32.4 90 top
XOR4-R6  19.6,39.2 180 top
XOR4-R7  22.8,39.2 0 top
XOR4-R8  23.3,32.4 90 top
XOR4-R9  22.8,41.3 180 top

### Tracks (layer width: path | path; a pad name or v marks a point on that pad's centre or on a via)
+5V  (via drill 0.5)
  Top 0.2: SEL3-R1.2 40.9,12 40.9,9.85 SEL3-R19.2 | OR1-R3.2 OR1-R5.2 | OR2-R3.2 OR2-R5.2 | SEL1-R4.2 45.2,28.2 44.7,28.2 43.05,28.2 SEL1-R9.2 43,28.2 v41.85,28.2 40.2,28.2 39.9,27.9 39.9,27.4 39.6,27.1 35,27.1 34.7,27.4 SEL1-R1.2 | XOR2-Q1.P$3 3.7,37.3 3.5,37.5 3.5,39.25 | 3.5,39.2 3.4,39.2 3.5,39.2 | 3.5,39.2 3.5,39.25 | 3.5,39.25 XOR2-R6.2 | 3.5,39.2 XOR2-R6.2 | XOR2-R6.2 3.75,40.05 4.1,40.4 6.05,40.4 XOR2-R9.2 | XOR3-Q1.P$3 18.7,24.3 18.5,24.5 18.5,26.25 | 18.5,26.2 18.4,26.2 18.5,26.2 | 18.5,26.2 18.5,26.25 | 18.5,26.25 XOR3-R6.2 | 18.5,26.2 XOR3-R6.2 | XOR3-R6.2 18.75,27.05 19.1,27.4 21.05,27.4 XOR3-R9.2 | XOR1-Q1.P$3 3.7,24.3 3.5,24.5 3.5,26.25 | 3.5,26.2 3.4,26.2 3.5,26.2 | 3.5,26.2 3.5,26.25 | 3.5,26.25 XOR1-R6.2 | 3.5,26.2 XOR1-R6.2 | XOR1-R6.2 3.75,27.05 4.1,27.4 6.05,27.4 XOR1-R9.2 | XOR4-Q1.P$3 18.7,37.3 18.5,37.5 18.5,39.25 | 18.5,39.2 18.4,39.2 18.5,39.2 | 18.5,39.2 18.5,39.25 | 18.5,39.25 XOR4-R6.2 | 18.5,39.2 XOR4-R6.2 | XOR4-R6.2 18.75,40.05 19.1,40.4 21.05,40.4 XOR4-R9.2
  Top 0.4: OR1-R5.2 38.6,39.65 41.5,42.55 43.6,42.55 46.5,39.65 OR2-R5.2 | NOT1-R2.1 44.85,16.3 v42.25,16.3 | v41.9,12.95 41,12.05 SEL3-R1.2 | v39.75,36.9 39.05,36.9 38.6,37.35 OR1-R3.2 | v20.45,29.25 20.5,29.25 21.65,28.1 XOR3-R9.2 | v20.4,36.9 20.05,37.25 19.35,37.25 XOR4-Q1.P$3 | L-R.A 28.77,47.77 | 28.77,47.77 28.65,47.9 23.45,47.9 L-C_IN.A 22.4,46.9 v20.9,45.4 | 36.02,47.52 35.65,47.9 28.9,47.9 28.77,47.77 | 36.02,47.52 L-C_OUT.A | v20.9,42.35 21.9,41.35 XOR4-R9.2 | CON2.2 13.55,1.3 7.8,1.3 7.8,4.75 5.85,6.7 5.75,6.7 L1.A 3.4,9.1 2.4,10.1 2.4,24.45 3.45,24.45 3.5,24.5 | XOR2-R9.2 7,41.35 7.2,41.35 7.2,45.65 L-A.A 8.7,47.1 9.5,47.9 14.65,47.9 15.07,47.48 | 15.07,47.48 L-B.A | 4.1,27.4 4.05,27.45 2.5,29 2.5,37.45 3.45,37.45 3.5,37.5 | v14.55,46.95 14.95,47.35 15.07,47.48 | v35.9,46.05 35.9,47.4 36.02,47.52
  Bottom 0.4: v41.9,12.95 41.9,16.25 v42.25,16.3 41.85,16.25 v41.85,28.2 41.75,28.35 41.75,34.9 v39.75,36.9 39.65,37.05 39.65,42.3 v35.9,46.05 | v20.45,29.25 20.4,29.3 v20.4,36.9 | v20.9,42.35 v20.9,45.4 20.75,45.5 19.3,46.95 v14.55,46.95
_EQUAL_IN  (via drill 0.5)
  Top 0.2: OR2-R1.1 43.25,30.05 v43.55,30.05 | v38.45,3.35 38.2,3.6 v31.9,3.6
  Bottom 0.2: v43.55,30.05 44.05,29.55 44.05,22.75 44.5,22.3 44.5,20.7 44.1,20.3 44.05,8.95 v38.45,3.35 | v31.9,3.6 31.7,3.4 31.7,1.65 31.35,1.3 CON2.15
_EQUAL_OUT  (via drill 0.5)
  Top 0.2: OR2-Q3.P$3 42.4,40.7 | 42.4,40.7 42.7,40.4 44.05,40.4 OR2-R5.1 | v38.95,35.8 39.35,36.2 40,36.2 40.7,36.9 40.7,40.65 42.35,40.65 42.4,40.7
  Bottom 0.2: v38.95,35.8 36.95,33.8 36.95,30.25 36.5,29.8 36.5,28.4 37,27.9 37,17.4 37.6,16.8 37.6,15.1 36.95,14.45 36.95,1.8 36.45,1.3 CON2.19
A  (via drill 0.5)
  Top 0.2: XOR2-R1.1 4.25,31.55 4.25,31.25 4.2,31.2 4.5,31.2 4.55,31.15 | XOR2-R4.1 15.3,30.6 15,30.3 5.7,30.3 5.4,30.3 4.55,31.15 | 9,43.5 8.95,43.55 U$1-R1.1 8.9,43.35 v8,42.45 | SEL3-R7.1 17.9,3.05 v14.6,3.05 | v4.95,31.55 4.6,31.2 4.55,31.15
  Bottom 0.2: v14.6,3.05 13.6,2.05 13.6,1.3 CON2.1 13.55,2.1 10.55,5.1 7.7,5.1 7.5,5.1 6.9,5.7 6.9,29.6 5,31.5 v4.95,31.55 4.95,39.4 v8,42.45
AND  (via drill 0.5)
  Top 0.2: XOR2-Q2.P$2 8.7,35.05 9.05,35.05 9.1,35 9.1,34.3 9.53,33.88 | 8.8,35.15 XOR2-Q2.P$2 | 10.65,33.2 XOR2-R3.2 10.7,33.3 9.6,33.3 | 8.65,35 XOR2-Q2.P$2 | 8.5,34.9 8.55,34.9 | 9.53,33.88 9.6,33.8 9.6,33.3 | 9.6,33.3 9.6,31.8 9.3,31.5 8.35,31.5 8.35,31.7 8.3,31.65 XOR2-R8.1 | SEL3-R15.1 38.35,5.9 v38.45,5.9 | v38.95,34.8 39.5,34.25 39.5,31.45 38.6,31.45 OR1-R2.1 | v45.35,29.25 45.1,29 v37.75,29 | v9.55,33.9 9.53,33.88
  Top 0.406: 8.55,34.9 8.75,34.9 XOR2-Q2.P$2
  Bottom 0.2: v38.45,5.9 38.85,6.3 38.85,29 | 38.85,29 38.85,34.7 v38.95,34.8 | v9.55,33.9 11.7,36.05 11.7,46.15 13.25,47.7 42.4,47.8 42.85,47.35 | 42.85,47.3 42.85,47.35 | 42.85,47.3 42.85,32.95 42.85,32.75 45.3,30.3 45.3,29.3 v45.35,29.25 | 42.85,47.3 42.85,47.35 | 42.85,47.35 42.85,47.3 | v37.75,29 38.8,29 38.85,29
B  (via drill 0.5)
  Top 0.2: XOR4-R4.1 30.3,30.6 30,30.3 20.7,30.3 20.4,30.3 19.5,31.2 19.2,31.2 19.25,31.25 19.25,31.55 XOR4-R1.1 18.75,31.55 v17.65,31.55 | 16,43.5 15.95,43.55 U$2-R1.1 15.9,43.35 15.9,41.65 v17.5,41.65 | v15.3,3.75 SEL3-R5.1
  Bottom 0.2: CON2.3 16.1,1.3 16.1,2.95 v15.3,3.75 15.35,3.8 16.2,4.65 16.2,27.6 17.5,28.9 17.5,31.4 v17.65,31.55 17.65,41.5 v17.5,41.65
CARRY_IN  (via drill 0.5)
  Top 0.2: XOR3-R4.1 30.3,17.6 30,17.3 20.7,17.3 20.4,17.3 19.5,18.2 19.2,18.2 | 19.25,18.25 19.25,18.55 XOR3-R1.1 19,18.6 v19.8,19.4 | 23,43.5 22.95,43.55 U$3-R1.1 22.9,43.35 22.9,42.35 v22.85,42.35
  Top 0.25: 19.25,18.25 19.2,18.2
  Bottom 0.2: v22.85,42.35 19.4,38.9 19.4,19.8 v19.8,19.4 19.75,19.35 19.3,18.9 18.9,18.5 18.9,14.5 19.3,14.1 19.3,1.95 18.65,1.3 CON2.5
CARRY_OUT  (via drill 0.5)
  Top 0.2: OR1-Q3.P$3 34.4,40.7 | 34.4,40.7 34.7,40.4 36.05,40.4 OR1-R5.1 36.9,39.65 38.7,41.45 39.75,41.45 39.75,43.95 39.6,44.1 37.6,44.1 37.05,43.55 U$5-R1.1 36.95,43.55 37,43.5 | v33.3,40.6 33.35,40.65 34.35,40.65 34.4,40.7
  Bottom 0.2: v33.3,40.6 33.3,1.85 33.85,1.3 CON2.17
GND  (via drill 0.5)
  Top 0.2: SEL3-Q2.P$2 10.75,8.65 10.8,8.7 10.8,8.8 11.8,9.8 11.8,13.2 12.2,13.6 12.3,13.7 16.2,13.7 | 16.2,13.7 20.6,13.7 | 20.6,13.7 25,13.7 | 25,13.7 29.4,13.7 | 29.4,13.7 33.8,13.7 | SEL3-Q4.P$2 15.15,8.65 15.2,8.7 15.2,8.8 16.2,9.8 16.2,13.7 | SEL3-Q6.P$2 19.6,8.6 19.6,8.8 20.6,9.8 20.6,13.7 | SEL3-Q8.P$2 24,8.6 24,8.8 25,9.8 25,13.7 | 28.5,8.6 28.4,8.6 | 28.3,8.6 SEL3-Q10.P$2 28.4,8.6 | 28.4,8.6 28.4,8.8 29.4,9.8 29.4,13.7 | SEL3-Q12.P$2 32.8,8.6 32.8,8.9 33.8,9.9 33.8,13.7 | SEL3-Q14.P$2 37.2,8.6 37.2,8.8 38.2,8.8 | 38.2,8.8 38.2,8.6 38.2,7.5 38.5,7.2 SEL3-Q17.P$2 39.1,7.15 | 38.2,8.8 38.2,13.3 37.8,13.7 33.8,13.7 | OR1-Q1.P$2 35.35,34.15 35.6,34.4 | 35.6,34.4 38.4,34.4 38.6,34.2 38.6,33.35 OR1-Q2.P$2 | 35.6,34.4 33.6,34.4 33.4,34.6 33.4,36.2 33.7,36.5 34.1,36.5 34.4,36.8 34.4,39 34.7,39.3 OR1-Q3.P$2 | OR2-Q1.P$2 43.35,34.15 43.6,34.4 | 43.6,34.4 46.4,34.4 46.6,34.2 46.6,33.35 OR2-Q2.P$2 | 43.6,34.4 41.6,34.4 41.4,34.6 41.4,36.2 41.7,36.5 42.1,36.5 42.4,36.8 42.4,39 42.7,39.3 OR2-Q3.P$2 | SEL1-Q4.P$2 39.7,24.5 | SEL1-Q2.P$2 39.9,20.4 38.4,20.4 37.9,20.9 35,20.9 34.95,20.95 34.6,21.3 34.6,23.7 34.9,24 36.5,24 36.7,23.8 36.7,22.7 36.9,22.5 38.5,22.5 38.8,22.8 38.8,24.4 | 38.8,24.4 39.85,24.4 SEL1-Q4.P$2 | SEL1-Q4.P$2 40.65,24.45 40.9,24.7 40.9,25.2 41.2,25.5 42.4,25.5 42.6,25.3 42.6,24 43,23.6 45.4,23.6 45.8,23.2 45.8,22.6 46,22.4 SEL1-Q3.P$2 46.8,22.45 | SEL1-Q6.P$2 38.8,24.4 | XOR2-R3.1 10.7,32.2 10.9,32.4 14.1,32.4 | 14.1,32.4 15.9,32.4 16.2,32.7 16.2,34.9 16.1,35 16.1,35.1 16.05,35.05 15.7,35.05 XOR2-Q4.P$2 | XOR2-Q3.P$2 12.3,35.1 12.3,34.4 12.6,34.1 13.8,34.1 14.1,33.8 14.1,32.4
  Top 0.2: XOR2-Q4.P$2 15.75,35.15 15.8,35.2 | 15.8,39.15 16.05,39.15 16.1,39.1 16.1,35.45 XOR2-Q4.P$2 | XOR2-Q5.P$2 12.25,40.15 12.5,40.4 15.2,40.4 15.5,40.4 15.8,40.1 15.8,39.5 15.7,39.35 XOR2-Q6.P$2 | XOR3-R3.1 25.7,19.2 25.9,19.4 29.1,19.4 29.1,20.8 28.8,21.1 27.6,21.1 27.3,21.4 27.3,22.1 XOR3-Q3.P$2 | XOR3-Q4.P$2 30.7,22.05 31.05,22.05 31.1,22.1 31.1,22 31.2,21.9 31.2,19.7 | XOR3-Q4.P$2 30.75,22.15 30.8,22.2 | 30.8,26.15 31.05,26.15 31.1,26.1 31.1,22.45 XOR3-Q4.P$2 | XOR3-Q5.P$2 27.25,27.15 27.5,27.4 30.2,27.4 30.5,27.4 30.8,27.1 30.8,26.5 30.7,26.35 XOR3-Q6.P$2 | XOR1-R3.1 10.7,19.2 10.9,19.4 14.1,19.4 | 14.1,19.4 15.9,19.4 16.2,19.7 16.2,21.9 16.1,22 16.1,22.1 16.05,22.05 15.7,22.05 XOR1-Q4.P$2 | XOR1-Q3.P$2 12.3,22.1 12.3,21.4 12.6,21.1 13.8,21.1 14.1,20.8 14.1,19.4 | XOR1-Q4.P$2 15.75,22.15 15.8,22.2 | 15.8,26.15 16.05,26.15 16.1,26.1 16.1,22.45 XOR1-Q4.P$2 | XOR1-Q5.P$2 12.25,27.15 12.5,27.4 15.2,27.4 15.5,27.4 15.8,27.1 15.8,26.5 15.7,26.35 XOR1-Q6.P$2 | XOR4-R3.1 25.7,32.2 25.9,32.4 29.1,32.4 | 29.1,32.4 30.9,32.4 | XOR4-Q4.P$2 30.7,35.05 31.05,35.05 31.1,35.1 31.1,35 31.2,34.9 31.2,34.55 31.2,32.7 | XOR4-Q3.P$2 27.3,35.1 27.3,34.4 27.6,34.1 28.8,34.1 29.1,33.8 29.1,32.4 | XOR4-Q4.P$2 30.75,35.15 30.8,35.2 | 30.8,39.15 31.05,39.15 31.1,39.1 31.1,35.45 XOR4-Q4.P$2 | XOR4-Q5.P$2 27.25,40.15 27.5,40.4 28.45,40.4 30.2,40.4 30.5,40.4 30.8,40.1 30.8,39.5 30.7,39.35 XOR4-Q6.P$2 | 11,43.15 U$1-Q1.P$2 | 18,43.15 U$2-Q1.P$2 | 25,43.15 U$3-Q1.P$2 | 32,43.15 U$4-Q1.P$2 | 39,43.15 U$5-Q1.P$2
  Top 0.25: 29.1,19.4 30.9,19.4 30.95,19.45 | 31.2,19.7 30.95,19.45 | 31.2,32.7 31.1,32.6 | 31.1,32.6 30.9,32.4 | 31,19.4 30.95,19.45 | v31.3,32.4 31.15,32.55 31.1,32.6
  Top 0.4: 33.4,34.6 33.35,34.55 31.25,34.55 31.2,34.55 | OR1-Q2.P$2 38.6,33.25 37.65,32.3 37.65,32.15 37.7,32.1 37.7,30.5 39.2,30.5 40.6,31.9 40.6,34.55 41.35,34.55 41.4,34.6 | 28.35,43.45 25.3,43.45 25.05,43.2 U$3-Q1.P$2 | 28.35,43.45 29.2,44.3 30.85,44.3 31.75,43.4 U$4-Q1.P$2 32.05,43.1 32.55,42.6 38.05,42.6 38.75,43.3 U$5-Q1.P$2 | v28.45,40.8 28.45,40.45 28.45,40.4 | v28.45,43.3 28.35,43.45 | 46.33,11.57 47.5,12.75 47.5,22.35 46.8,22.35 SEL1-Q3.P$2 | 46.33,11.57 NOT1-Q1.P$2 | 31,19.4 32.25,19.4 32.25,18.55 32.65,18.15 34.55,18.15 34.55,20.55 34.9,20.9 34.95,20.95 | v12.4,42.55 11.6,42.55 11.05,43.1 U$1-Q1.P$2 | v12.4,40.6 12.4,40.45 12.45,40.45 12.5,40.4 | v16.8,42.35 17.75,43.3 U$2-Q1.P$2 | v16.7,40.35 16.5,40.15 15.85,40.15 15.8,40.1 | v12.45,27.6 12.45,27.45 12.5,27.4 | R1.1 4.7,13.65 12.15,13.65 | 12.15,13.65 12.2,13.6 | SEL3-Q10.P$2 28.4,8.6 | v37.65,2.5 36.45,1.3 CON2.20 | v38.55,4.9 39.25,5.6 39.25,7.1 39.15,7.1 SEL3-Q17.P$2 | v12.25,13.8 12.15,13.65 | v47.05,10.85 46.45,11.45 46.33,11.57 | v30.9,27.8 30.55,27.45 30.5,27.4
  Top 0.406: 15.8,39.15 15.75,39.15 XOR2-Q6.P$2 | 30.8,26.15 30.75,26.15 XOR3-Q6.P$2 | 15.8,26.15 15.75,26.15 XOR1-Q6.P$2 | 30.8,39.15 30.75,39.15 XOR4-Q6.P$2
  Bottom 0.4: v28.45,43.3 v28.45,40.8 | v12.4,42.55 v12.4,40.6 12.45,40.45 v12.45,27.6 12.35,27.45 12.25,27.35 v12.25,13.8 | v16.8,42.35 16.7,42.25 v16.7,40.35 | v38.55,4.9 37.65,4 v37.65,2.5 37.8,2.55 38.75,2.55 v47.05,10.85 | v31.3,32.4 30.9,32 v30.9,27.8
  pour Bottom: 0,0 0,50 50,50 50,0
INVERT_OUT  (via drill 0.5)
  Top 0.2: XOR1-R5.1 12.95,18.5 12.8,18.5 12,17.7 6.4,17.7 6.1,18 XOR1-R2.1 6.05,18.6 5.35,19.3 3,19.3 3,17.95 5.05,15.9 19.6,15.9 v20,15.5
  Bottom 0.2: v20,15.5 20,2.45 21.15,1.3 CON2.7
LEFT_A  (via drill 0.5)
  Top 0.2: 43.5,22.45 SEL1-R7.1 43.45,22.4 43.45,21.35 v43.35,21.35 | v42.85,15.5 42.75,15.6 36.95,15.6 36.75,15.8 32.35,15.8 31.2,16.95 31.2,18.6 v31.45,18.6
  Bottom 0.2: v43.35,21.35 43.35,16 v42.85,15.5 | v31.45,18.6 28.25,18.6 28,18.4 28,4.5 26.3,2.8 26.3,1.3 CON2.11
N$1  (via drill 0.5)
  Top 0.2: SEL3-R19.1 39.4,9.8 39.6,9.8 39.6,8.6 | 39.6,8.6 39.6,8.5 39.8,8.3 40.1,8 SEL3-Q17.P$3 | XOR1-R1.1 4.25,18.55 4.25,18.25 4.2,18.2 4.5,18.2 5.4,17.3 5.7,17.3 15,17.3 15.3,17.6 XOR1-R4.1 15.35,18.6 15.6,18.6 v16.9,19.9 | v39.55,8.6 39.6,8.6
  Bottom 0.2: 39.5,8.6 39.45,8.6 39.5,8.6 | 39.5,8.6 v39.55,8.6 | 39.5,8.6 39.2,8.9 39.2,34.1 39.65,34.55 39.65,36.05 38.7,37 38.7,38.8 31.1,46.4 29.2,46.4 22.1,46.4 21.6,45.9 21.6,41.6 19,39 19,22 v16.9,19.9
N$2  (via drill 0.5)
  Top 0.2: XOR2-R5.1 12.95,31.5 12.8,31.5 12,30.7 6.4,30.7 6.1,31 XOR2-R2.1 6.05,31.6 5.35,32.3 3,32.3 3,30.95 4,29.95 21.1,29.95 v21.45,29.6 | XOR4-Q6.P$3 28,41.5 XOR4-Q5.P$3 25.3,41.5 25.1,41.3 24.8,41.3 XOR4-R9.1 23.6,41.25 23.6,40.25 v22.85,40.25
  Bottom 0.2: v22.85,40.25 22.8,40.2 22.8,30.95 v21.45,29.6
N$3
  Top 0.2: NOT1-R2.2 44,15.3 44,13.8 44.4,13.4 NOT1-Q1.P$3 45.05,13.35 45.05,10.55 45.35,10.25 46.6,10.25 46.6,8.65 46.45,8.5 46.1,8.5 41.65,4.05 33.7,4.05 SEL3-R13.1
N$5  (via drill 0.5)
  Top 0.2: SEL1-Q6.P$3 41.8,27.1 42.2,26.7 42.75,26.7 SEL1-R9.1 | 43.05,26.5 SEL1-R9.1 | SEL3-R3.1 11.85,5.8 v12,5.8 | v14.75,45.4 15.7,46.35 16.05,46.35 16.4,46.7 16.4,48.35 41.2,48.35 42.85,46.7 42.85,43 44.55,43 47.4,40.15 47.4,27.2 43.75,27.2 43.1,26.55 SEL1-R9.1
  Bottom 0.2: v12,5.8 15.5,9.3 15.5,28.2 14.9,28.8 14.9,30.2 15.5,30.8 15.5,44.65 v14.75,45.4
N$6
  Top 0.2: L1.C R1.2
N$8  (via drill 0.5)
  Top 0.2: XOR3-Q2.P$2 23.7,22.05 24.05,22.05 24.1,22 24.1,21.3 24.52,20.88 | 23.8,22.15 XOR3-Q2.P$2 | 25.65,20.2 XOR3-R3.2 25.7,20.3 24.6,20.3 | 23.65,22 XOR3-Q2.P$2 | 23.5,21.9 23.55,21.9 | 24.52,20.88 24.6,20.8 24.6,20.3 | 24.6,20.3 24.6,18.8 24.3,18.5 23.35,18.5 23.35,18.7 23.3,18.65 XOR3-R8.1 | OR1-R1.1 34.25,30.4 30.6,30.4 30.15,29.95 28.45,29.95 v27.7,29.2 | v24.55,20.9 24.52,20.88
  Top 0.406: 23.55,21.9 23.75,21.9 XOR3-Q2.P$2
  Bottom 0.2: v27.7,29.2 28.1,28.8 28.1,24.45 v24.55,20.9
NOR  (via drill 0.5)
  Top 0.2: XOR2-Q4.P$3 14.8,36.8 13.7,36.8 | 13.7,36.8 11.4,36.8 11.3,36.9 XOR2-Q3.P$3 10.6,37.3 10.5,37.4 10.1,37.8 9.6,38.3 8.1,38.3 7.8,38.6 7.8,39 7.6,39.2 XOR2-R7.1 6.9,39.25 5.2,39.25 XOR2-R6.1 | NOT1-R1.1 45.05,8.5 v42.65,8.5 | v40.35,16.3 40.15,16.5 v36.25,16.5 | v26.5,45.4 25.3,44.2 21.45,44.2 20.8,43.55 19.15,43.55 18.5,44.2 v14.8,44.2 | v13.7,36.9 13.7,36.85 13.7,36.8
  Bottom 0.2: v42.65,8.5 40.35,10.8 v40.35,16.3 | v36.25,16.5 34,18.75 34,40.85 29.45,45.4 v26.5,45.4 | v14.8,44.2 13.7,43.1 v13.7,36.9
NOT1-N$14
  Top 0.2: NOT1-R1.2 44.15,9.35 44.1,9.4 44.1,11.15 NOT1-Q1.P$1
OR1-N$7
  Top 0.2: OR1-R1.2 33.5,31.4 33.4,31.5 33.4,33.25 OR1-Q1.P$1
OR1-N$9
  Top 0.2: OR1-R2.2 36.7,31.4 36.7,33.25 OR1-Q2.P$1
OR1-N$10
  Top 0.2: OR1-R4.2 33.4,37.4 33.4,39.25 OR1-Q3.P$1
OR1-N$11
  Top 0.2: OR1-Q2.P$3 37.7,37.1 37.4,37.4 OR1-R3.1 OR1-R4.1 35.25,35.75 35,35.5 OR1-Q1.P$3
OR2-N$7
  Top 0.2: OR2-R1.2 41.5,31.4 41.4,31.5 41.4,33.25 OR2-Q1.P$1
OR2-N$9
  Top 0.2: OR2-R2.2 44.7,31.4 44.7,33.25 OR2-Q2.P$1
OR2-N$10
  Top 0.2: OR2-R4.2 41.4,37.4 41.4,39.25 OR2-Q3.P$1
OR2-N$11
  Top 0.2: OR2-Q2.P$3 45.7,37.1 45.4,37.4 OR2-R3.1 OR2-R4.1 43.25,35.75 43,35.5 OR2-Q1.P$3
RESULT  (via drill 0.5)
  Top 0.2: XOR1-R9.1 9.8,28.3 10.1,28.3 10.3,28.5 XOR1-Q5.P$3 13,28.5 XOR1-Q6.P$3 14.85,28.55 15.55,29.25 v16.2,29.25 | 30,43.5 29.95,43.55 U$4-R1.1 29.9,43.35 v32.3,40.95 | v32.6,2.55 33.85,1.3 CON2.18 | v16.65,31.5 17.55,32.4 v22.1,32.4
  Bottom 0.2: v32.3,40.95 32.6,40.65 32.6,40.1 | v32.6,2.55 32.6,2.5 32.9,2.9 32.9,3.2 32.9,39.4 32.6,39.7 32.6,40.1 | v16.2,29.25 16.65,29.7 v16.65,31.5 | v22.1,32.4 22.15,32.45 22.15,40.5 22.6,40.95 26.85,40.95 27.9,39.9 32.55,39.9 32.6,40.1
RIGHT_A  (via drill 0.5)
  Top 0.2: 43.6,17.9 43.6,18 43.6,17.9 | 43.6,17.9 43.5,18 SEL1-R3.1 43.4,17.95 42.65,17.2 v31.9,17.2
  Bottom 0.2: v31.9,17.2 31.85,17.2 31.65,17.4 28.85,17.4 28.85,1.3 CON2.13
S_ADD  (via drill 0.5)
  Top 0.2: v21.9,3.6 SEL3-R8.1 | v22.4,2.2 21.5,1.3 21.2,1.3 CON2.8
  Bottom 0.2: v21.9,3.6 22.4,3.1 v22.4,2.2
S_AND
  Top 0.2: SEL3-R14.1 34.35,5.6 30.05,5.6 29.3,4.85 29.3,3.95 26,3.95 25.3,3.25 22.5,3.25 22.05,2.8 20.15,2.8 18.65,1.3 CON2.6
S_ID  (via drill 0.5)
  Top 0.2: v17.5,3.75 SEL3-R6.1 | v17.3,2.35 16.25,1.3 16.15,1.3 CON2.4
  Bottom 0.2: v17.5,3.75 17.3,3.55 v17.3,2.35
S_LOAD  (via drill 0.5)
  Top 0.2: SEL3-R4.1 14.05,5.8 v20.8,5.8 | v21.15,16.2 21.9,16.95 29.15,16.95 v29.55,16.55 | v30.15,2.05 30.9,1.3 31.35,1.3 CON2.16
  Bottom 0.2: v20.8,5.8 21.15,6.15 v21.15,16.2 | v29.55,16.55 30.15,15.95 v30.15,2.05
S_OR
  Top 0.2: SEL3-R12.1 28.75,2.9 24.8,2.9 23.75,1.85 23.75,1.3 CON2.10
S_SHIFT  (via drill 0.5)
  Top 0.2: SEL3-R2.1 9.65,5.8 v9.8,5.8 | v14.8,16.6 14.85,16.65 v20.2,16.65 | v22.15,16.25 22.55,15.85 v30.85,15.85 | v30.85,3.7 28.85,1.7 28.85,1.3 CON2.14
  Bottom 0.2: v9.8,5.8 14.8,10.8 v14.8,16.6 | v20.2,16.65 20.25,16.65 20.5,16.9 21.55,16.9 v22.15,16.25 | v30.85,3.7 v30.85,15.85
S_XOR  (via drill 0.5)
  Top 0.2: SEL3-R10.1 25.4,3.95 v25.05,3.95 | v25.05,2.2 25.95,1.3 26.25,1.3 CON2.12
  Bottom 0.2: v25.05,2.2 v25.05,3.95
SEL1-I-S2
  Top 0.2: SEL1-Q3.P$3 45.8,24.8 45.5,25.1 | 45.5,25.1 45.5,26.15 SEL1-R4.1 | 45.5,25.1 45.5,24.9 SEL1-Q3.P$3 | SEL1-Q3.P$3 SEL1-R6.1
SEL1-N$53
  Top 0.2: SEL1-R2.2 41.75,20.15 41.4,19.8 41,19.4 40.8,19.2 40.7,19.1 39,19.1 38.8,18.9 38.8,18.3 38.6,18.1 35.75,18.1 SEL1-Q1.P$1
SEL1-N$55
  Top 0.2: SEL1-R3.2 41.5,18 41.4,18.1 39.95,18.1 SEL1-Q2.P$1
SEL1-N$56
  Top 0.2: SEL1-Q2.P$3 37.7,19.7 37.5,19.9 35.75,19.9 SEL1-Q1.P$2
SEL1-N$57
  Top 0.2: SEL1-Q5.P$1 35.7,21.9 36.1,21.5 40.9,21.5 42.2,21.5 42.6,21.9 42.6,23.3 42.4,23.5 42.1,23.5 41.75,23.85 SEL1-R6.2
SEL1-N$58
  Top 0.2: SEL1-R7.2 41.8,22.5 39.95,22.5 SEL1-Q4.P$1
SEL1-N$59
  Top 0.2: SEL1-Q4.P$3 37.7,24.6 37.4,24.9 35.75,24.9 SEL1-Q5.P$2
SEL1-N$60
  Top 0.2: SEL1-Q6.P$1 37,28.05 SEL1-R8.2
SEL1-N$62
  Top 0.2: SEL1-R5.2 46.65,20.45 46.6,20.5 46.6,21 46.3,21.3 45,21.3 44.8,21.5 44.8,22.35 SEL1-Q3.P$1
SEL1-SEL_INT1
  Top 0.2: SEL1-Q1.P$3 33.5,19.1 SEL1-Q5.P$3 | 33.1,24.1 33.3,23.9 33.4,24 SEL1-Q5.P$3 | SEL1-Q5.P$3 33.6,24.1 33.6,26 33.85,26.25 SEL1-R1.1 SEL1-R8.1
SEL3-N$27
  Top 0.2: SEL3-R2.2 8.7,7.1 8.4,7.4 8.1,7.7 8,7.8 8,12.3 8.3,12.6 SEL3-Q1.P$1
SEL3-N$28
  Top 0.2: SEL3-R3.2 10.9,7.2 10.6,7.5 9.1,7.5 8.9,7.7 8.9,8.55 SEL3-Q2.P$1
SEL3-N$29
  Top 0.2: SEL3-Q2.P$3 9.8,11 10.2,11.4 10.7,11.9 10.7,12.55 SEL3-Q1.P$2
SEL3-N$32
  Top 0.2: SEL3-R4.2 13.1,7.1 12.4,7.8 12.4,12.3 12.7,12.6 SEL3-Q3.P$1
SEL3-N$33
  Top 0.2: SEL3-R5.2 15.3,7.2 15.1,7.4 15,7.5 13.5,7.5 13.3,7.7 13.3,8.55 SEL3-Q4.P$1
SEL3-N$34
  Top 0.2: SEL3-Q4.P$3 14.2,11 15.1,11.9 15.1,12.55 SEL3-Q3.P$2
SEL3-N$35
  Top 0.2: SEL3-R6.2 17.5,7.1 16.8,7.8 16.8,12.3 17.1,12.6 SEL3-Q5.P$1
SEL3-N$36
  Top 0.2: SEL3-R7.2 19.7,7.2 19.4,7.5 17.9,7.5 17.7,7.7 17.7,8.55 SEL3-Q6.P$1
SEL3-N$37
  Top 0.2: SEL3-Q6.P$3 18.6,11 19.5,11.9 19.5,12.55 SEL3-Q5.P$2
SEL3-N$38
  Top 0.2: SEL3-R8.2 21.9,7.1 21.2,7.8 21.2,12.4 21.4,12.6 SEL3-Q7.P$1
SEL3-N$39
  Top 0.2: SEL3-R9.2 24.1,7.2 23.8,7.5 22.3,7.5 22.1,7.7 22.1,8.55 SEL3-Q8.P$1
SEL3-N$40
  Top 0.2: SEL3-Q8.P$3 23,11 23.9,11.9 23.9,12.55 SEL3-Q7.P$2
SEL3-N$41
  Top 0.2: SEL3-R10.2 26.3,7.1 25.6,7.8 25.6,12.3 25.9,12.6 SEL3-Q9.P$1
SEL3-N$42
  Top 0.2: SEL3-R11.2 28.5,7.2 28.2,7.5 26.6,7.5 26.4,7.7 26.4,8.55 SEL3-Q10.P$1
SEL3-N$43
  Top 0.2: SEL3-Q10.P$3 27.4,11 28.3,11.9 28.3,12.55 SEL3-Q9.P$2
SEL3-N$44
  Top 0.2: SEL3-R12.2 30.7,7.1 30,7.8 30,12.3 30.3,12.6 SEL3-Q11.P$1
SEL3-N$45
  Top 0.2: SEL3-R13.2 32.9,7.2 32.6,7.5 31,7.5 30.8,7.7 30.8,8.55 SEL3-Q12.P$1
SEL3-N$46
  Top 0.2: SEL3-Q12.P$3 31.8,11 32.7,11.9 32.7,12.55 SEL3-Q11.P$2
SEL3-N$47
  Top 0.2: SEL3-R14.2 35.1,7.1 34.4,7.8 34.4,12.3 34.6,12.5 35.15,12.5 SEL3-Q13.P$1
SEL3-N$48
  Top 0.2: SEL3-R15.2 37.3,7.2 37,7.5 35.5,7.5 35.3,7.7 35.3,8.55 SEL3-Q14.P$1
SEL3-N$49
  Top 0.2: SEL3-Q14.P$3 36.2,11 37.1,11.9 37.1,12.55 SEL3-Q13.P$2
SEL3-N$54
  Top 0.2: SEL3-R18.2 41,14.2 40.3,14.2 40.1,14 40.1,9.2 40.1,9 41,8.1 41,7.25 SEL3-Q17.P$1
SEL3-SEL_INT
  Top 0.2: SEL3-Q1.P$3 SEL3-Q3.P$3 SEL3-Q5.P$3 SEL3-Q7.P$3 SEL3-Q9.P$3 SEL3-Q11.P$3 SEL3-Q13.P$3 36.25,14.8 36.35,14.8 36.4,14.8 38.9,14.8 39.3,14.4 39.3,14.25 SEL3-R18.1 39.3,14.2 39.3,12.05 SEL3-R1.1
SUBTRACT  (via drill 0.5)
  Top 0.2: 45,20.15 SEL1-R5.1 SEL1-R2.1 43.4,20.15 43.4,19.15 v42.65,19.15 | XOR4-R2.1 21.1,31 21.4,30.7 27,30.7 27.8,31.5 27.95,31.5 XOR4-R5.1 28.05,31.5 28.65,31.5 v29.15,31 | v42.55,30.05 30.75,30.05 30.15,29.45 28.9,29.45 v28.7,29.25
  Bottom 0.2: v42.65,19.15 42.55,19.25 v42.55,30.05 | v29.15,31 29.15,29.7 v28.7,29.25 28.65,29.2 28.65,24.05 24.35,19.75 24.35,1.9 23.75,1.3 CON2.9
SUM  (via drill 0.5)
  Top 0.2: SEL3-R9.1 23.15,5.8 v23,5.8 | v22.85,27.25 23.85,28.25 XOR3-R9.1 24.8,28.3 25.1,28.3 25.3,28.5 XOR3-Q5.P$3 28,28.5 XOR3-Q6.P$3 29.85,28.55 31,29.7 38,29.7 38.35,29.35 44.5,29.35 OR2-R2.1
  Bottom 0.2: v23,5.8 22.85,5.95 22.8,15.3 23.3,15.8 23.3,20.1 22.85,20.55 v22.85,27.25
U$1-INT
  Top 0.2: U$1-R2.1 L-A.C
U$1-N$1
  Top 0.2: U$1-Q1.P$3 13.2,44.3 13.2,46.95 U$1-R2.2
U$1-N$16
  Top 0.2: U$1-R1.2 8.9,45.3 8.9,45.4 10.75,45.4 U$1-Q1.P$1
U$2-INT
  Top 0.2: U$2-R2.1 L-B.C
U$2-N$1
  Top 0.2: U$2-Q1.P$3 20.2,44.3 20.2,46.95 U$2-R2.2
U$2-N$16
  Top 0.2: U$2-R1.2 15.9,45.3 15.9,45.4 17.75,45.4 U$2-Q1.P$1
U$3-INT
  Top 0.2: U$3-R2.1 L-C_IN.C
U$3-N$1
  Top 0.2: U$3-Q1.P$3 27.2,44.3 27.2,46.95 U$3-R2.2
U$3-N$16
  Top 0.2: U$3-R1.2 22.9,45.3 22.9,45.4 24.75,45.4 U$3-Q1.P$1
U$4-INT
  Top 0.2: U$4-R2.1 L-R.C
U$4-N$1
  Top 0.2: U$4-Q1.P$3 34.2,44.3 34.2,46.95 U$4-R2.2
U$4-N$16
  Top 0.2: U$4-R1.2 29.9,45.3 29.9,45.4 31.75,45.4 U$4-Q1.P$1
U$5-INT
  Top 0.2: U$5-R2.1 L-C_OUT.C
U$5-N$1
  Top 0.2: U$5-Q1.P$3 41.2,44.3 41.2,46.95 U$5-R2.2
U$5-N$16
  Top 0.2: U$5-R1.2 36.9,45.3 36.9,45.4 38.75,45.4 U$5-Q1.P$1
XOR  (via drill 0.5)
  Top 0.2: XOR2-R9.1 9.8,41.3 10.1,41.3 10.3,41.5 XOR2-Q5.P$3 13,41.5 XOR2-Q6.P$3 14.85,41.45 15.25,41.05 17.15,41.05 17.6,40.6 v18.35,40.6 | 26.85,17.7 21.4,17.7 21.1,18 XOR3-R2.1 21.15,18.6 21.3,18.6 v22.1,19.4 | 26.85,17.7 27,17.7 27.8,18.5 27.95,18.5 XOR3-R5.1 | SEL3-R11.1 27.65,5.7 v27.3,5.7 | v26.85,18 26.85,17.75 26.85,17.7 | v18.2,29.25 19.35,28.1 v20.1,28.1
  Bottom 0.2: v27.3,5.7 26.85,6.15 v26.85,18 | v18.35,40.6 18.35,29.4 v18.2,29.25 | v20.1,28.1 22.1,26.1 v22.1,19.4
XOR1-AND
  Top 0.2: XOR1-Q2.P$2 8.7,22.05 9.05,22.05 9.1,22 9.1,21.3 9.6,20.8 9.6,20.3 | 8.8,22.15 XOR1-Q2.P$2 | 10.65,20.2 XOR1-R3.2 10.7,20.3 9.6,20.3 | 8.65,22 XOR1-Q2.P$2 | 8.5,21.9 8.55,21.9 | 9.6,20.3 9.6,18.8 9.3,18.5 8.35,18.5 8.35,18.7 8.3,18.65 XOR1-R8.1
  Top 0.406: 8.55,21.9 8.75,21.9 XOR1-Q2.P$2
XOR1-N$19
  Top 0.2: XOR1-Q1.P$2 5.25,22.95 5.5,23.2 7.5,23.2 7.8,23.5 XOR1-Q2.P$3
XOR1-N$21
  Top 0.2: XOR1-R1.2 3.9,20.3 3.8,20.3 3.5,20.5 3.5,21.95 XOR1-Q1.P$1
XOR1-N$22
  Top 0.2: XOR1-R2.2 6.45,20.25 6.7,20.5 6.7,21.95 XOR1-Q2.P$1
XOR1-N$23
  Top 0.2: 10.7,21.75 10.53,21.93 | 10.53,21.93 XOR1-Q3.P$1 | 10.53,21.93 10.5,21.85 10.4,21.75 10.4,21.6 10.7,21.5 11,21.5 12,20.5 12.6,20.5 12.95,20.25 XOR1-R5.2
XOR1-N$24
  Top 0.2: 13.9,22.05 XOR1-Q4.P$1 14.2,21.75 14.2,21.6 14.9,20.9 14.9,20.5 15.25,20.25 XOR1-R4.2
XOR1-N$25
  Top 0.2: XOR1-R8.2 8.3,20.7 7.8,21.2 7.8,22.9 8.1,23.2 15.5,23.2 15.7,23.4 15.7,25 15.5,25.2 15.4,25.3 14.1,25.3 13.9,25.5 13.8,25.6 13.8,26.25 XOR1-Q6.P$1
XOR1-N$26
  Top 0.2: XOR1-R7.2 10.25,26.2 XOR1-Q5.P$1
XOR1-NOR
  Top 0.2: XOR1-Q4.P$3 14.8,23.8 11.4,23.8 11.3,23.9 XOR1-Q3.P$3 10.6,24.3 10.5,24.4 10.1,24.8 9.6,25.3 8.1,25.3 7.8,25.6 7.8,26 7.6,26.2 XOR1-R7.1 6.9,26.25 5.2,26.25 XOR1-R6.1
XOR2-N$19
  Top 0.2: XOR2-Q1.P$2 5.25,35.95 5.5,36.2 7.5,36.2 7.8,36.5 XOR2-Q2.P$3
XOR2-N$21
  Top 0.2: XOR2-R1.2 3.9,33.3 3.8,33.3 3.5,33.5 3.5,34.95 XOR2-Q1.P$1
XOR2-N$22
  Top 0.2: XOR2-R2.2 6.45,33.25 6.7,33.5 6.7,34.95 XOR2-Q2.P$1
XOR2-N$23
  Top 0.2: 10.7,34.75 10.53,34.92 | 10.53,34.92 XOR2-Q3.P$1 | 10.53,34.92 10.5,34.85 10.4,34.75 10.4,34.6 10.7,34.5 11,34.5 12,33.5 12.6,33.5 12.95,33.25 XOR2-R5.2
XOR2-N$24
  Top 0.2: 13.9,35.05 XOR2-Q4.P$1 14.2,34.75 14.2,34.6 14.9,33.9 14.9,33.5 15.25,33.25 XOR2-R4.2
XOR2-N$25
  Top 0.2: XOR2-R8.2 8.3,33.7 7.8,34.2 7.8,35.9 8.1,36.2 15.5,36.2 15.7,36.4 15.7,38 15.5,38.2 15.4,38.3 14.1,38.3 13.9,38.5 13.8,38.6 13.8,39.25 XOR2-Q6.P$1
XOR2-N$26
  Top 0.2: XOR2-R7.2 10.25,39.2 XOR2-Q5.P$1
XOR3-N$19
  Top 0.2: XOR3-Q1.P$2 20.25,22.95 20.5,23.2 22.5,23.2 22.8,23.5 XOR3-Q2.P$3
XOR3-N$21
  Top 0.2: XOR3-R1.2 18.9,20.3 18.8,20.3 18.5,20.5 18.5,21.95 XOR3-Q1.P$1
XOR3-N$22
  Top 0.2: XOR3-R2.2 21.45,20.25 21.7,20.5 21.7,21.95 XOR3-Q2.P$1
XOR3-N$23
  Top 0.2: 25.7,21.75 25.52,21.93 | 25.52,21.93 XOR3-Q3.P$1 | 25.52,21.93 25.5,21.85 25.4,21.75 25.4,21.6 25.7,21.5 26,21.5 27,20.5 27.6,20.5 27.95,20.25 XOR3-R5.2
XOR3-N$24
  Top 0.2: 28.9,22.05 XOR3-Q4.P$1 29.2,21.75 29.2,21.6 29.9,20.9 29.9,20.5 30.25,20.25 XOR3-R4.2
XOR3-N$25
  Top 0.2: XOR3-R8.2 23.3,20.7 22.8,21.2 22.8,22.9 23.1,23.2 30.5,23.2 30.7,23.4 30.7,25 30.5,25.2 30.4,25.3 29.1,25.3 28.9,25.5 28.8,25.6 28.8,26.25 XOR3-Q6.P$1
XOR3-N$26
  Top 0.2: XOR3-R7.2 25.25,26.2 XOR3-Q5.P$1
XOR3-NOR
  Top 0.2: XOR3-Q4.P$3 29.8,23.8 26.4,23.8 26.3,23.9 XOR3-Q3.P$3 25.6,24.3 25.5,24.4 25.1,24.8 24.6,25.3 23.1,25.3 22.8,25.6 22.8,26 22.6,26.2 XOR3-R7.1 21.9,26.25 20.2,26.25 XOR3-R6.1
XOR4-AND
  Top 0.2: XOR4-Q2.P$2 23.7,35.05 24.05,35.05 24.1,35 24.1,34.3 24.6,33.8 24.6,33.3 | 23.8,35.15 XOR4-Q2.P$2 | 25.65,33.2 XOR4-R3.2 25.7,33.3 24.6,33.3 | 23.65,35 XOR4-Q2.P$2 | 23.5,34.9 23.55,34.9 | 24.6,33.3 24.6,31.8 24.3,31.5 23.35,31.5 23.35,31.7 23.3,31.65 XOR4-R8.1
  Top 0.406: 23.55,34.9 23.75,34.9 XOR4-Q2.P$2
XOR4-N$19
  Top 0.2: XOR4-Q1.P$2 20.25,35.95 20.5,36.2 22.5,36.2 22.8,36.5 XOR4-Q2.P$3
XOR4-N$21
  Top 0.2: XOR4-R1.2 18.9,33.3 18.8,33.3 18.5,33.5 18.5,34.95 XOR4-Q1.P$1
XOR4-N$22
  Top 0.2: XOR4-R2.2 21.45,33.25 21.7,33.5 21.7,34.95 XOR4-Q2.P$1
XOR4-N$23
  Top 0.2: 25.7,34.75 25.52,34.92 | 25.52,34.92 XOR4-Q3.P$1 | 25.52,34.92 25.5,34.85 25.4,34.75 25.4,34.6 25.7,34.5 26,34.5 27,33.5 27.6,33.5 27.95,33.25 XOR4-R5.2
XOR4-N$24
  Top 0.2: 28.9,35.05 XOR4-Q4.P$1 29.2,34.75 29.2,34.6 29.9,33.9 29.9,33.5 30.25,33.25 XOR4-R4.2
XOR4-N$25
  Top 0.2: XOR4-R8.2 23.3,33.7 22.8,34.2 22.8,35.9 23.1,36.2 30.5,36.2 30.7,36.4 30.7,38 30.5,38.2 30.4,38.3 29.1,38.3 28.9,38.5 28.8,38.6 28.8,39.25 XOR4-Q6.P$1
XOR4-N$26
  Top 0.2: XOR4-R7.2 25.25,39.2 XOR4-Q5.P$1
XOR4-NOR
  Top 0.2: XOR4-Q4.P$3 29.8,36.8 26.4,36.8 26.3,36.9 XOR4-Q3.P$3 25.6,37.3 25.5,37.4 25.1,37.8 24.6,38.3 23.1,38.3 22.8,38.6 22.8,39 22.6,39.2 XOR4-R7.1 21.9,39.25 20.2,39.25 XOR4-R6.1

### Text on the board
tPlace: PWR
bPlace: A | B | C-I | C-O | R | XOR | XOR | OR | OR | XOR | XOR | MUX | v0.1 | MUX | NOT | Gator / ALU slice